# EAGLE board A13-OLinuXino_WIFI_Rev_G2 (EAGLE 9.6.2), part 1 of 3
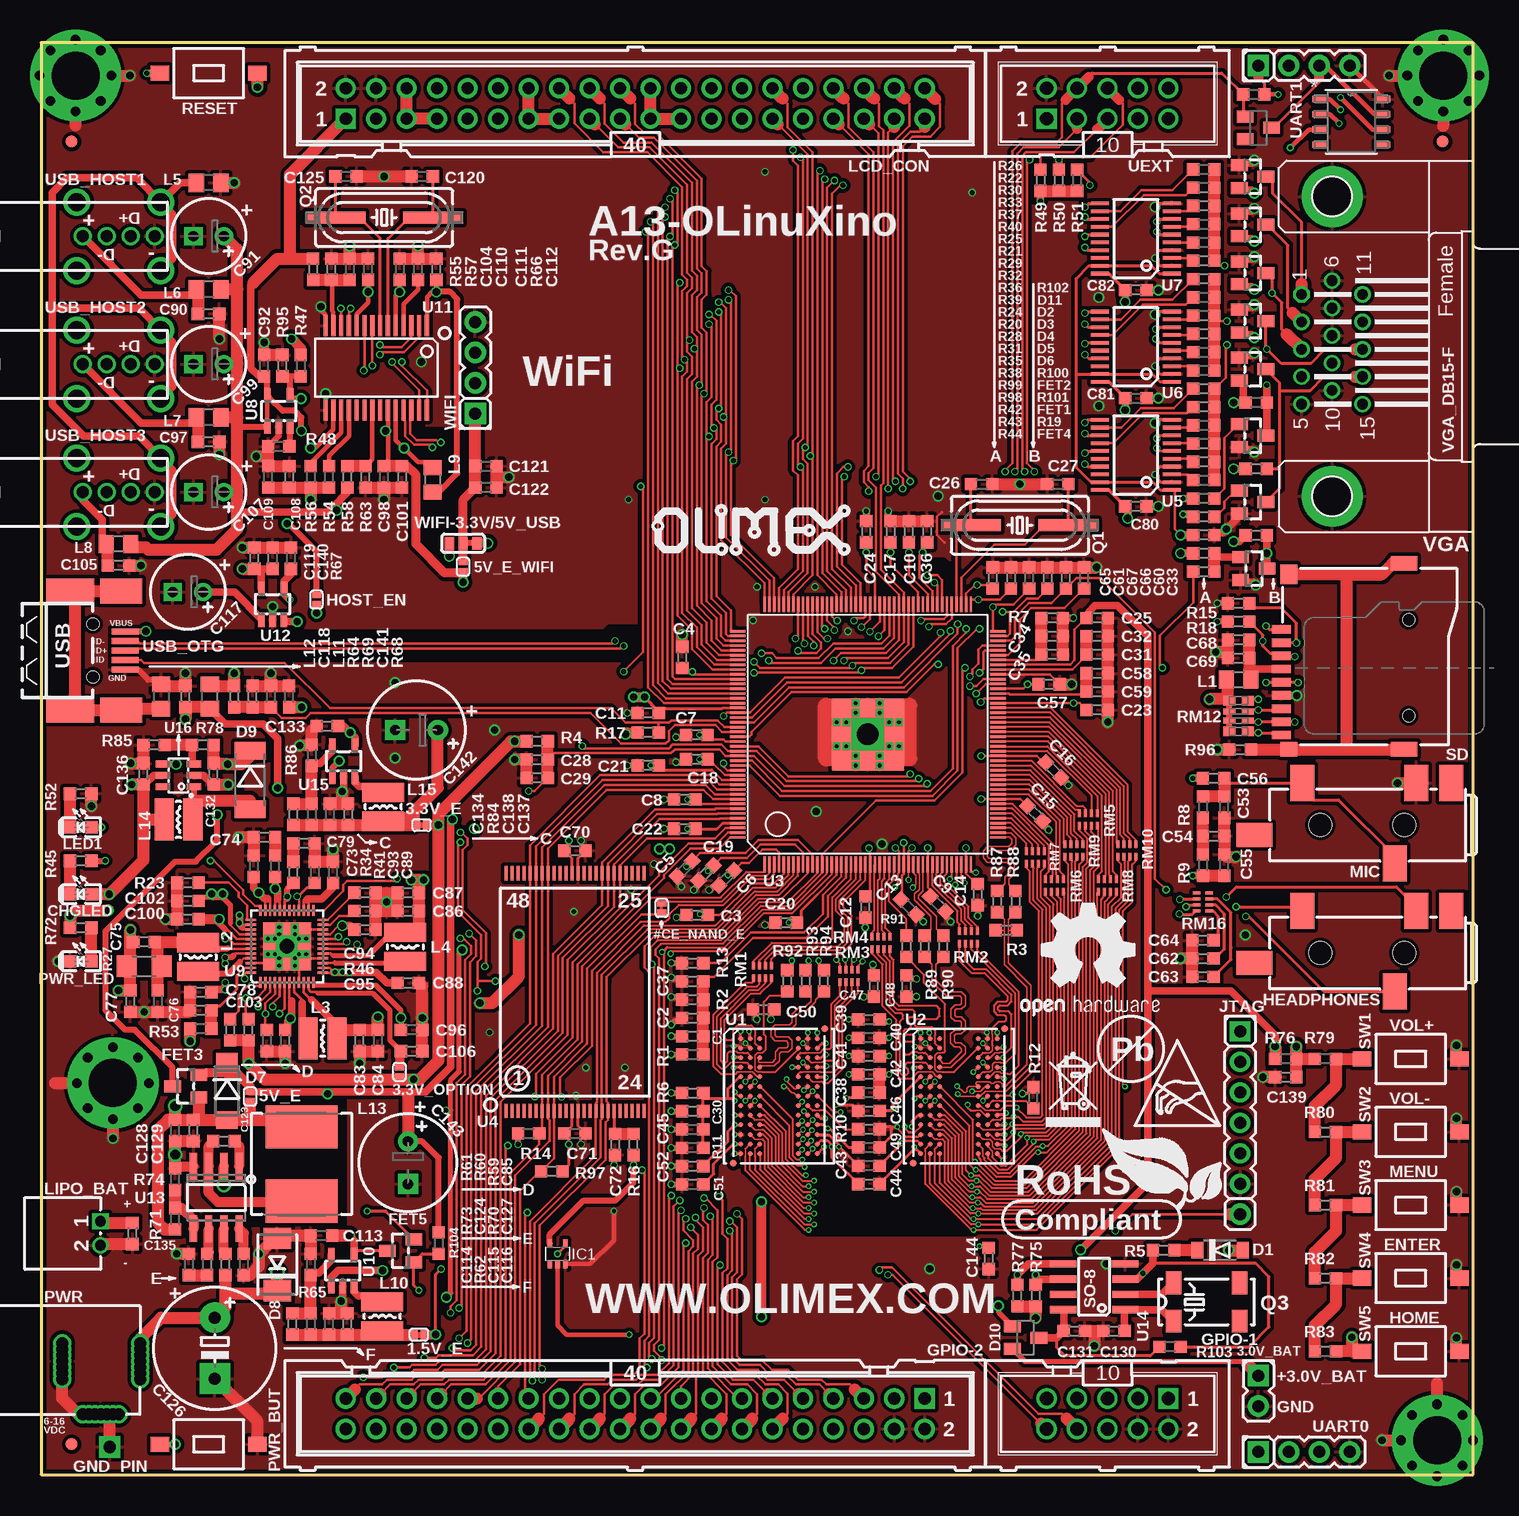
[diagram p2: board, top side]
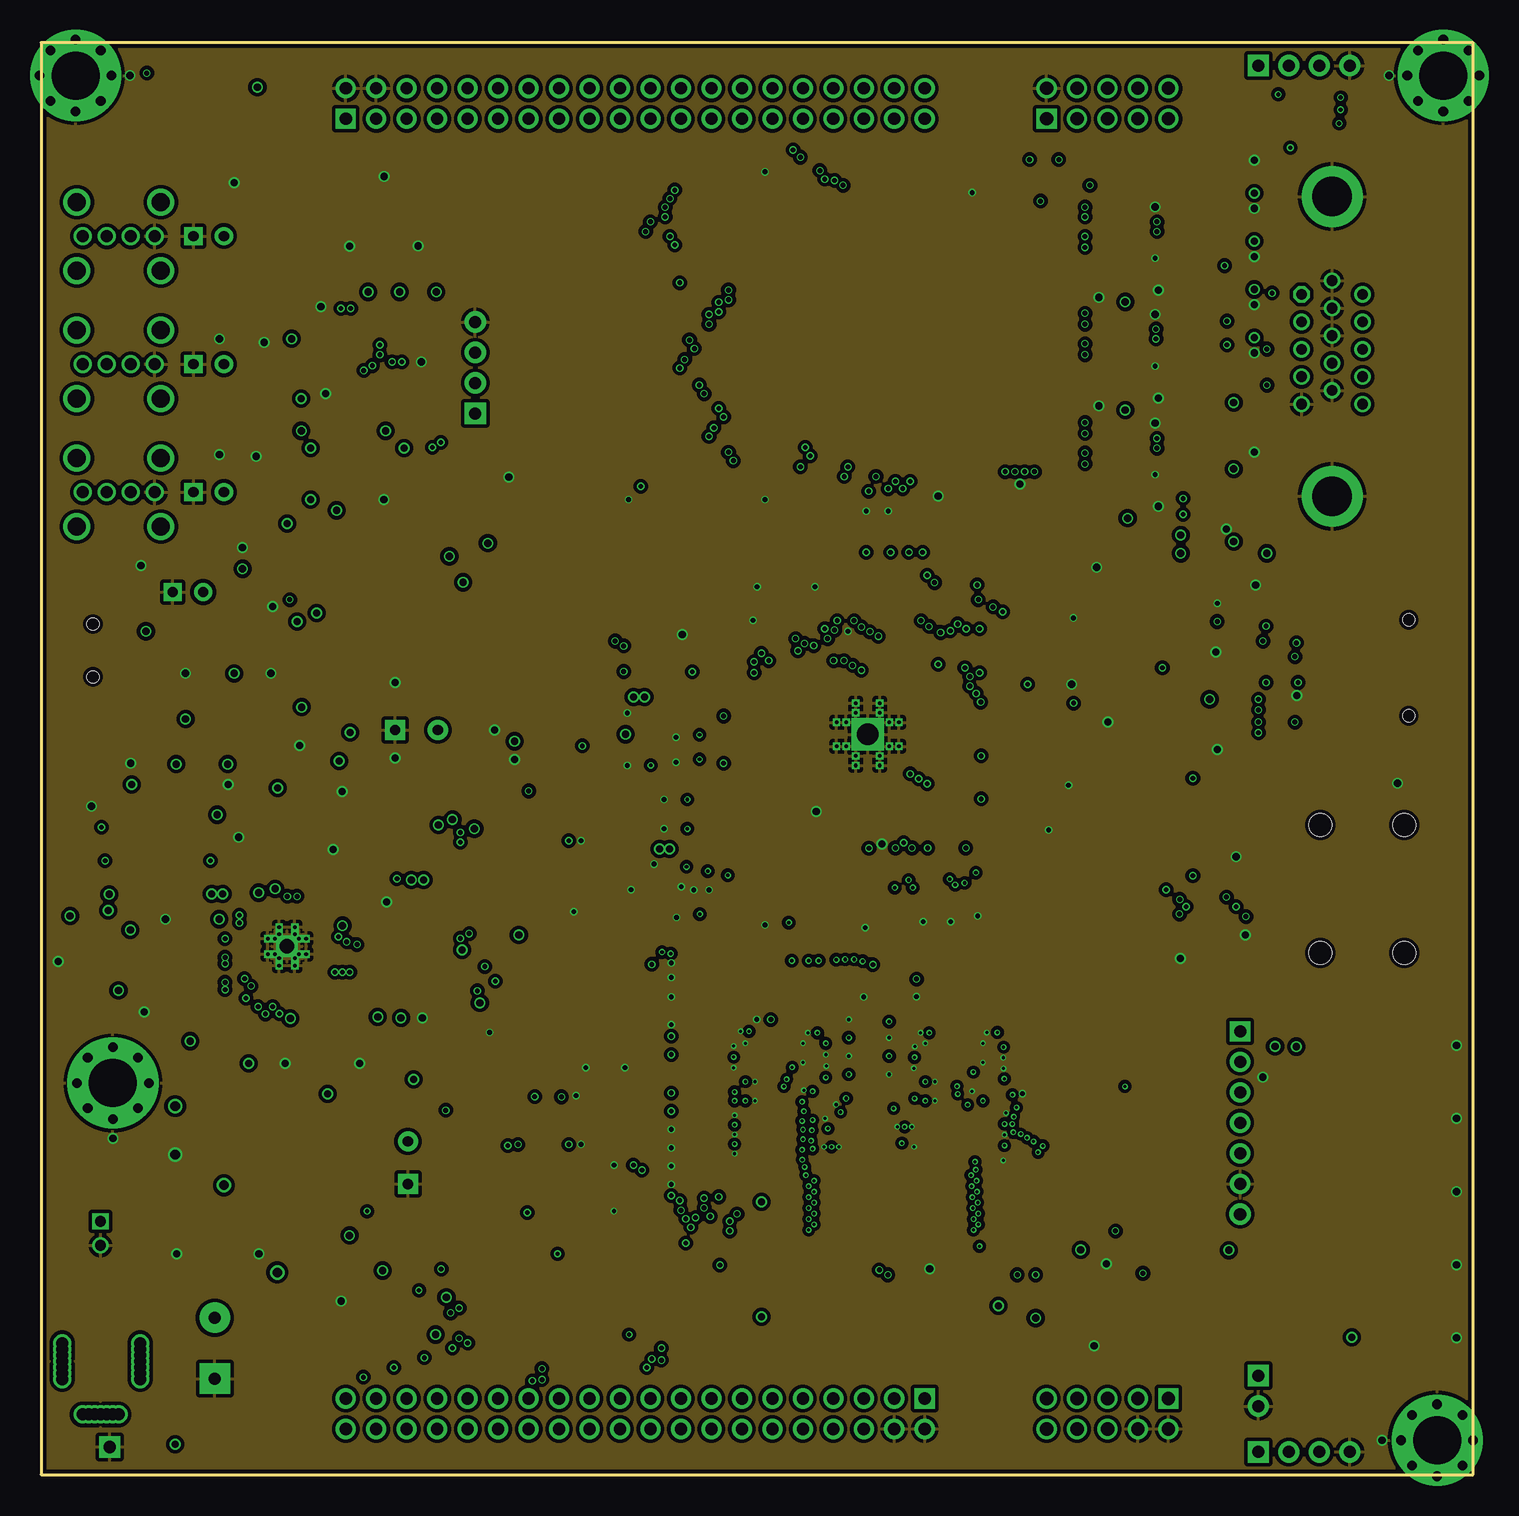
[diagram p3: board, inner layer Route2]
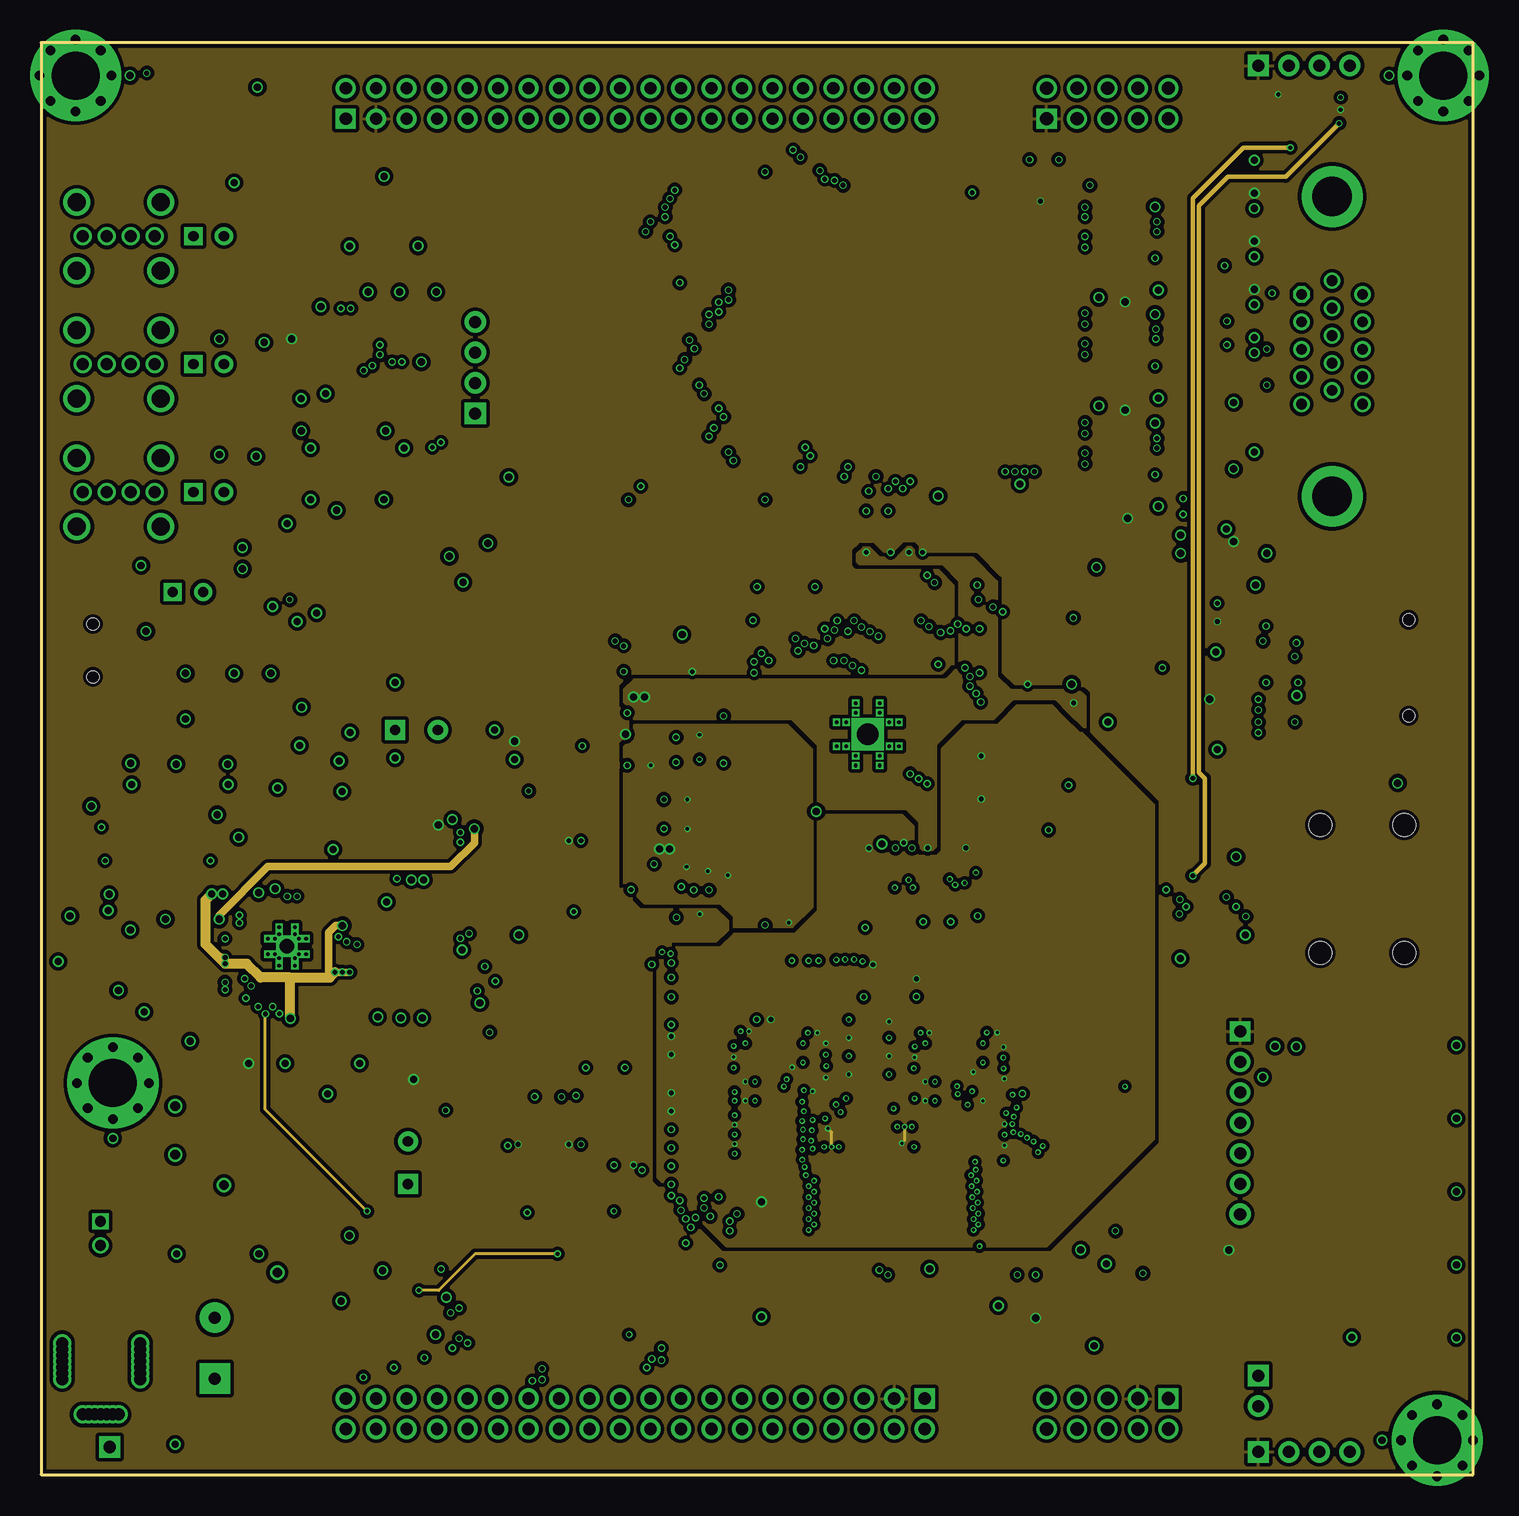
[diagram p4: board, inner layer Route15]
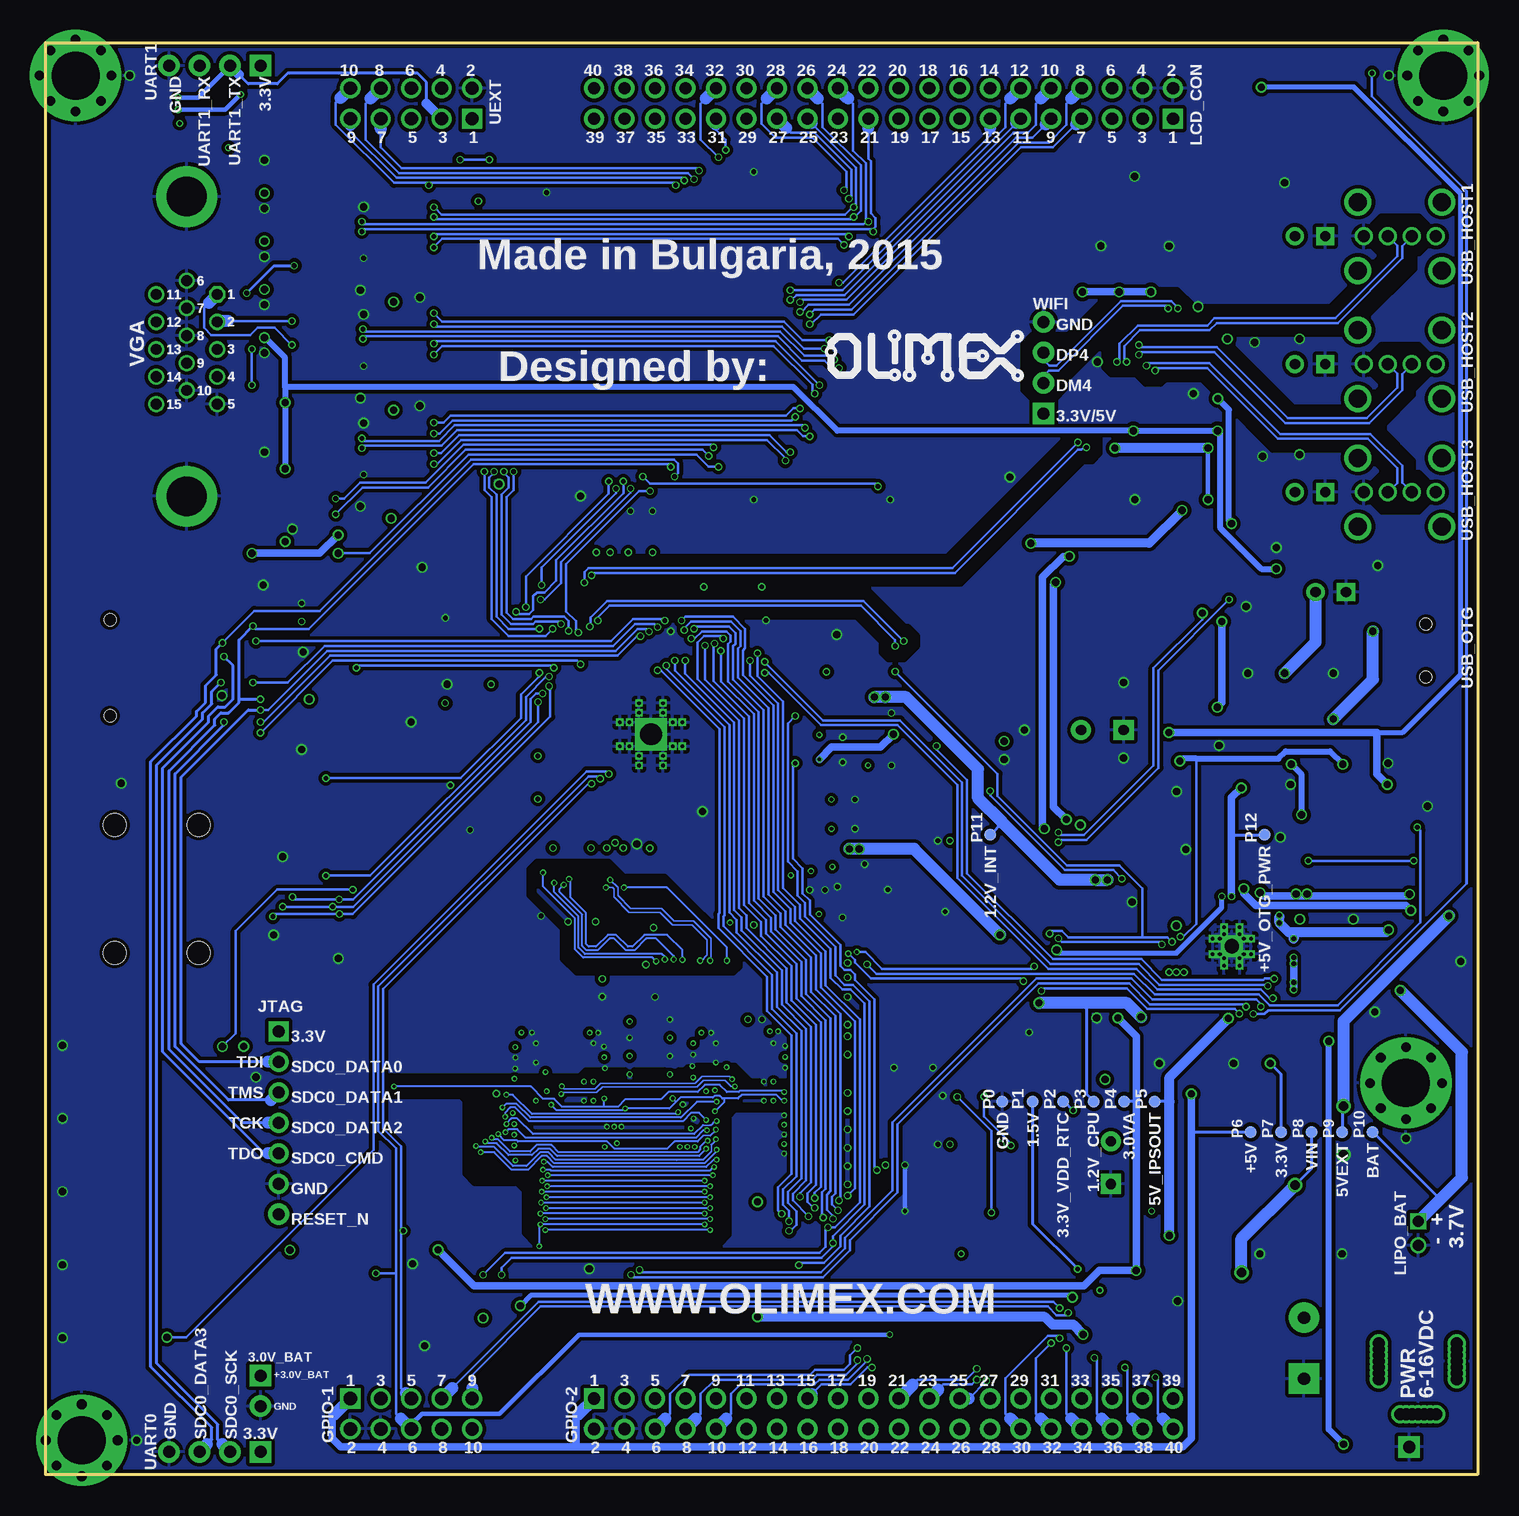
[diagram p5: board, bottom side, seen from below]

Size 119.38 x 119.38 mm. Coordinates in mm from the lower left corner, seen from the top.
Copper layers (1*2*15*16): Top 0.018mm / dielectric 0.12mm / Route2 0.035mm / dielectric 1.2mm / Route15 0.035mm / dielectric 0.12mm / Bottom 0.018mm
Design rules "default": minimum track width 4.5mil, minimum drill 10mil, track to track 0.1321mm, track to pad 0.1321mm, pad to pad 0.1321mm, via to via 0.1321mm, smd to smd 1mil, copper to edge 10mil, drill to drill 8mil, minimum pad ring 6mil, minimum via ring 4mil, stop-mask expansion 4mil, vias tented up to drill 25mil, thermal gap 12mil
tRestrict: 58 lines
bRestrict: 173 lines

## Footprints (pad centres in the part's own frame; a part is rotated, then mirrored left to right if it is on the bottom)
SJ_1_SMALLER_CLOSE = smd 0.508 x 0.762: 1 -0.381,0; 2 0.381,0
HN1X2 = drill 1 pad 1.778 square: 1 -1.27,0 | drill 1 pad 1.778: 2 1.27,0
SJ_1_SMALLER = smd 0.508 x 0.762: 1 -0.381,0; 2 0.381,0
SJ_1_SMALLER_CLOSE_10MILS = smd 0.508 x 0.762: 1 -0.381,0; 2 0.381,0
C0603_DWS = smd 1.016 x 1.016: 1 -0.889,0; 2 0.889,0
E2,5-6,3 = drill 0.864 pad 1.524: + -1.27,0 | drill 0.864 pad 1.524 square: - 1.27,0
E5-10,5 = drill 1.016 pad 2.54: + -2.54,0 | drill 1.016 pad 2.54 square: - 2.54,0
E3,5-8 = drill 0.864 pad 1.676: + -1.778,0 | drill 0.864 pad 1.676 square: - 1.778,0
LED-0603 = smd 1.016 x 1.016: A 0.889,0; C -0.889,0
SOD-123 = smd 1 x 1.4: A 1.9,0; C -1.9,0
SOT23C(BAT54S) = smd 1.4 x 1: 1 1.1,-0.95; 2 1.1,0.95; 3 -1.1,0
MLL-41 = smd 1.45 x 1.8: A 2.445,0; K -2.445,0
DO214AA = smd 1.778 x 2.286: A 2.177,0; C -2.177,0
MELF-MLL41 = smd 1.45 x 2.6: 1 -2.445,0; 2 2.445,0
SOT23C = smd 1.4 x 1: 1 1.1,-0.95; 2 1.1,0.95; 3 -1.1,0
SOT23 = smd 1.4 x 1: 1 1.1,-0.95; 2 1.1,0.95; 3 -1.1,0
TEST_PAD40/70/SQUARE = drill 1.016 pad 1.778 square: P$1 0,0
ML10-MALE = drill 1.1 pad 1.676 square: 1 -5.08,-1.27 | drill 1.1 pad 1.676: 2 -5.08,1.27; 3 -2.54,-1.27; 4 -2.54,1.27; 5 0,-1.27; 6 0,1.27; 7 2.54,-1.27; 8 2.54,1.27; 9 5.08,-1.27; 10 5.08,1.27
ML40 = drill 1.016 pad 1.676 square: 1 -24.13,-1.27 | drill 1.016 pad 1.676: 2 -24.13,1.27; 3 -21.59,-1.27; 4 -21.59,1.27; 5 -19.05,-1.27; 6 -19.05,1.27; 7 -16.51,-1.27; 8 -16.51,1.27; 9 -13.97,-1.27; 10 -13.97,1.27; 11 -11.43,-1.27; 12 -11.43,1.27; 13 -8.89,-1.27; 14 -8.89,1.27; 15 -6.35,-1.27; 16 -6.35,1.27; 17 -3.81,-1.27; 18 -3.81,1.27; 19 -1.27,-1.27; 20 -1.27,1.27; 21 1.27,-1.27; 22 1.27,1.27; 23 3.81,-1.27; 24 3.81,1.27; 25 6.35,-1.27; 26 6.35,1.27; 27 8.89,-1.27; 28 8.89,1.27; 29 11.43,-1.27; 30 11.43,1.27; 31 13.97,-1.27; 32 13.97,1.27; 33 16.51,-1.27; 34 16.51,1.27; 35 19.05,-1.27; 36 19.05,1.27; 37 21.59,-1.27; 38 21.59,1.27; 39 24.13,-1.27; 40 24.13,1.27
PJ-W47S-05D2-LF_5PIN_V2 = smd 2 x 3: 1 2.1,-0.5; 2 14.5,-0.5; 3 6.8,6.2; 5 5,-0.5 | smd 3 x 2: 4 18.5,3.8 | hole 1.9: 6,3; 13,3
SC70-5 = smd 0.4 x 0.7: 1 -0.65,-0.85; 2 0,-0.85; 3 0.65,-0.85; 4 0.65,0.85; 5 -0.65,0.85
HN1X6 = drill 1 pad 1.676 square: 1 -6.35,0 | drill 1 pad 1.676: 2 -3.81,0; 3 -1.27,0; 4 1.27,0; 5 3.81,0; 6 6.35,0
L0805_5MIL_DWS = smd 1.27 x 1.524: 1 -1.016,0; 2 1.016,0
CD32 = smd 1.6 x 3.5: 1 -1.2,0; 2 1.2,0
8X8MM_3131 = smd 3.6 x 6: 1 -3.1,0; 2 3.1,0
DW02R = drill 0.9 square: 1 -1,0 | drill 0.9: 2 1,0
TESTPAD_40-ROUND = smd 1.016 x 1.016: 1 0,0
PWR_JACK_UNI_MILLING = drill 1: + 0,4.75; +1 0,5.25; +2 0,5.75; +3 0,6.25; +4 0,4.25; +5 0,3.75; +6 0,3.25; - -6.5,4.75; -1 -6.5,5.25; -2 -6.5,5.75; -3 -6.5,4.25; -4 -6.5,3.75; -5 -6.5,6.25; -6 -6.5,3.25; -- -3.3,0.3; --1 -3.8,0.3; --2 -4.3,0.3; --3 -4.8,0.3; --4 -2.8,0.3; --5 -2.3,0.3; --6 -1.8,0.3
SW-TAKT_6X3.5_SMD = smd 1.27 x 1.524: P$1 0,4.064; P$2 0,-4.064
HC49/SMD2_THIN = smd 5 x 1: 1 -4.064,0; 2 4.064,0
MC-306 = smd 1.3 x 1.9: 1 -2.75,-1.6; 2 2.75,-1.6; 3 2.75,1.6; 4 -2.75,1.6
R0603_5MIL_DWS = smd 1.016 x 1.016: 1 -0.889,0; 2 0.889,0
R1206_5MIL_WS = smd 1.651 x 1.778: 1 -1.46,0; 2 1.46,0
TESTPAD = drill 1.016 pad 1.778: P$1 0,0
R_MATRIX_4_0402_25X625 = smd 0.25 x 0.625: 1.1 -0.75,-0.512; 1.2 -0.75,0.512; 2.1 -0.25,-0.512; 2.2 -0.25,0.512; 3.1 0.25,-0.512; 3.2 0.25,0.512; 4.1 0.75,-0.512; 4.2 0.75,0.512
R_MATRIX_4 = smd 0.762 x 1.016: 1.1 -1.27,-0.762; 1.2 -1.27,0.762; 4.1 1.27,-0.762; 4.2 1.27,0.762 | smd 0.508 x 1.016: 2.1 -0.381,-0.762; 2.2 -0.381,0.762; 3.1 0.381,-0.762; 3.2 0.381,0.762
TFC-WPAPR-08 = smd 1.6 x 0.7: 1 -7.375,2.25; 2 -7.375,1.15; 3 -7.375,0.05; 4 -7.375,-1.05; 5 -7.375,-2.15; 6 -7.375,-3.25; 7 -7.375,-4.35; 8 -7.375,-5.45; 9 -7.375,-6.55 | smd 1.4 x 1.2: 10 -6.75,-7.75 | smd 1.4 x 1.6: 11 -6.75,6.85 | smd 2.2 x 1.2: 12 2.85,-7.75; 13 2.85,7.75 | hole 1: 3.25,-4.95; 3.25,3.05
FBGA78 = smd 0.4 x 0.4: A1 -4.8,-3.2; A2 -4.8,-2.4; A3 -4.8,-1.6; A7 -4.8,1.6; A8 -4.8,2.4; A9 -4.8,3.2; B1 -4,-3.2; B2 -4,-2.4; B3 -4,-1.6; B7 -4,1.6; B8 -4,2.4; B9 -4,3.2; C1 -3.2,-3.2; C2 -3.2,-2.4; C3 -3.2,-1.6; C7 -3.2,1.6; C8 -3.2,2.4; C9 -3.2,3.2; D1 -2.4,-3.2; D2 -2.4,-2.4; D3 -2.4,-1.6; D7 -2.4,1.6; D8 -2.4,2.4; D9 -2.4,3.2; E1 -1.6,-3.2; E2 -1.6,-2.4; E3 -1.6,-1.6; E7 -1.6,1.6; E8 -1.6,2.4; E9 -1.6,3.2; F1 -0.8,-3.2; F2 -0.8,-2.4; F3 -0.8,-1.6; F7 -0.8,1.6; F8 -0.8,2.4; F9 -0.8,3.2; G1 0,-3.2; G2 0,-2.4; G3 0,-1.6; G7 0,1.6; G8 0,2.4; G9 0,3.2; H1 0.8,-3.2; H2 0.8,-2.4; H3 0.8,-1.6; H7 0.8,1.6; H8 0.8,2.4; H9 0.8,3.2; J1 1.6,-3.2; J2 1.6,-2.4; J3 1.6,-1.6; J7 1.6,1.6; J8 1.6,2.4; J9 1.6,3.2; K1 2.4,-3.2; K2 2.4,-2.4; K3 2.4,-1.6; K7 2.4,1.6; K8 2.4,2.4; K9 2.4,3.2; L1 3.2,-3.2; L2 3.2,-2.4; L3 3.2,-1.6; L7 3.2,1.6; L8 3.2,2.4; L9 3.2,3.2; M1 4,-3.2; M2 4,-2.4; M3 4,-1.6; M7 4,1.6; M8 4,2.4; M9 4,3.2; N1 4.8,-3.2; N2 4.8,-2.4; N3 4.8,-1.6; N7 4.8,1.6; N8 4.8,2.4; N9 4.8,3.2 | smd 0.6 x 0.6: FID1 5.6,-3.8; FID2 -5.6,3.8
TQFP176 = smd 0.2 x 1.3: 1 -8.6,-10.85; 2 -8.2,-10.85; 3 -7.8,-10.85; 4 -7.4,-10.85; 5 -7,-10.85; 6 -6.6,-10.85; 7 -6.2,-10.85; 8 -5.8,-10.85; 9 -5.4,-10.85; 10 -5,-10.85; 11 -4.6,-10.85; 12 -4.2,-10.85; 13 -3.8,-10.85; 14 -3.4,-10.85; 15 -3,-10.85; 16 -2.6,-10.85; 17 -2.2,-10.85; 18 -1.8,-10.85; 19 -1.4,-10.85; 20 -1,-10.85; 21 -0.6,-10.85; 22 -0.2,-10.85; 23 0.2,-10.85; 24 0.6,-10.85; 25 1,-10.85; 26 1.4,-10.85; 27 1.8,-10.85; 28 2.2,-10.85; 29 2.6,-10.85; 30 3,-10.85; 31 3.4,-10.85; 32 3.8,-10.85; 33 4.2,-10.85; 34 4.6,-10.85; 35 5,-10.85; 36 5.4,-10.85; 37 5.8,-10.85; 38 6.2,-10.85; 39 6.6,-10.85; 40 7,-10.85; 41 7.4,-10.85; 42 7.8,-10.85; 43 8.2,-10.85; 44 8.6,-10.85; 89 8.6,10.85; 90 8.2,10.85; 91 7.8,10.85; 92 7.4,10.85; 93 7,10.85; 94 6.6,10.85; 95 6.2,10.85; 96 5.8,10.85; 97 5.4,10.85; 98 5,10.85; 99 4.6,10.85; 100 4.2,10.85; 101 3.8,10.85; 102 3.4,10.85; 103 3,10.85; 104 2.6,10.85; 105 2.2,10.85; 106 1.8,10.85; 107 1.4,10.85; 108 1,10.85; 109 0.6,10.85; 110 0.2,10.85; 111 -0.2,10.85; 112 -0.6,10.85; 113 -1,10.85; 114 -1.4,10.85; 115 -1.8,10.85; 116 -2.2,10.85; 117 -2.6,10.85; 118 -3,10.85; 119 -3.4,10.85; 120 -3.8,10.85; 121 -4.2,10.85; 122 -4.6,10.85; 123 -5,10.85; 124 -5.4,10.85; 125 -5.8,10.85; 126 -6.2,10.85; 127 -6.6,10.85; 128 -7,10.85; 129 -7.4,10.85; 130 -7.8,10.85; 131 -8.2,10.85; 132 -8.6,10.85 | smd 1.3 x 0.2: 45 10.85,-8.6; 46 10.85,-8.2; 47 10.85,-7.8; 48 10.85,-7.4; 49 10.85,-7; 50 10.85,-6.6; 51 10.85,-6.2; 52 10.85,-5.8; 53 10.85,-5.4; 54 10.85,-5; 55 10.85,-4.6; 56 10.85,-4.2; 57 10.85,-3.8; 58 10.85,-3.4; 59 10.85,-3; 60 10.85,-2.6; 61 10.85,-2.2; 62 10.85,-1.8; 63 10.85,-1.4; 64 10.85,-1; 65 10.85,-0.6; 66 10.85,-0.2; 67 10.85,0.2; 68 10.85,0.6; 69 10.85,1; 70 10.85,1.4; 71 10.85,1.8; 72 10.85,2.2; 73 10.85,2.6; 74 10.85,3; 75 10.85,3.4; 76 10.85,3.8; 77 10.85,4.2; 78 10.85,4.6; 79 10.85,5; 80 10.85,5.4; 81 10.85,5.8; 82 10.85,6.2; 83 10.85,6.6; 84 10.85,7; 85 10.85,7.4; 86 10.85,7.8; 87 10.85,8.2; 88 10.85,8.6; 133 -10.85,8.6; 134 -10.85,8.2; 135 -10.85,7.8; 136 -10.85,7.4; 137 -10.85,7; 138 -10.85,6.6; 139 -10.85,6.2; 140 -10.85,5.8; 141 -10.85,5.4; 142 -10.85,5; 143 -10.85,4.6; 144 -10.85,4.2; 145 -10.85,3.8; 146 -10.85,3.4; 147 -10.85,3; 148 -10.85,2.6; 149 -10.85,2.2; 150 -10.85,1.8; 151 -10.85,1.4; 152 -10.85,1; 153 -10.85,0.6; 154 -10.85,0.2; 155 -10.85,-0.2; 156 -10.85,-0.6; 157 -10.85,-1; 158 -10.85,-1.4; 159 -10.85,-1.8; 160 -10.85,-2.2; 161 -10.85,-2.6; 162 -10.85,-3; 163 -10.85,-3.4; 164 -10.85,-3.8; 165 -10.85,-4.2; 166 -10.85,-4.6; 167 -10.85,-5; 168 -10.85,-5.4; 169 -10.85,-5.8; 170 -10.85,-6.2; 171 -10.85,-6.6; 172 -10.85,-7; 173 -10.85,-7.4; 174 -10.85,-7.8; 175 -10.85,-8.2; 176 -10.85,-8.6 | smd 6 x 6: GND_PAD 0,0 | drill 1.8 pad 2.184 square: P$2 0,0 | drill 0.3 pad 0.406 square: P$3 -2.6,-1; P$4 -1.8,-1; P$5 -1,-2.6; P$6 -1,-1.8; P$7 1,-2.6; P$8 1,-1.8; P$9 2.6,-1; P$10 1.8,-1; P$11 -2.6,1; P$12 -1.8,1; P$13 2.6,1; P$14 1.8,1; P$15 -1,2.6; P$16 -1,1.8; P$17 1,2.6; P$18 1,1.8
TSOP48 = smd 1.2 x 0.25: 1 -9.9,5.75; 2 -9.9,5.25; 3 -9.9,4.75; 4 -9.9,4.25; 5 -9.9,3.75; 6 -9.9,3.25; 7 -9.9,2.75; 8 -9.9,2.25; 9 -9.9,1.75; 10 -9.9,1.25; 11 -9.9,0.75; 12 -9.9,0.25; 13 -9.9,-0.25; 14 -9.9,-0.75; 15 -9.9,-1.25; 16 -9.9,-1.75; 17 -9.9,-2.25; 18 -9.9,-2.75; 19 -9.9,-3.25; 20 -9.9,-3.75; 21 -9.9,-4.25; 22 -9.9,-4.75; 23 -9.9,-5.25; 24 -9.9,-5.75; 25 9.9,-5.75; 26 9.9,-5.25; 27 9.9,-4.75; 28 9.9,-4.25; 29 9.9,-3.75; 30 9.9,-3.25; 31 9.9,-2.75; 32 9.9,-2.25; 33 9.9,-1.75; 34 9.9,-1.25; 35 9.9,-0.75; 36 9.9,-0.25; 37 9.9,0.25; 38 9.9,0.75; 39 9.9,1.25; 40 9.9,1.75; 41 9.9,2.25; 42 9.9,2.75; 43 9.9,3.25; 44 9.9,3.75; 45 9.9,4.25; 46 9.9,4.75; 47 9.9,5.25; 48 9.9,5.75
PW = smd 0.3 x 1.5: 1 -2.925,-3; 2 -2.275,-3; 3 -1.625,-3; 4 -0.975,-3; 5 -0.325,-3; 6 0.325,-3; 7 0.975,-3; 8 1.625,-3; 9 2.275,-3; 10 2.925,-3; 11 2.925,3; 12 2.275,3; 13 1.625,3; 14 0.975,3; 15 0.325,3; 16 -0.325,3; 17 -0.975,3; 18 -1.625,3; 19 -2.275,3; 20 -2.925,3
SOT23-5 = smd 1.2 x 0.55: 1 1.3,-0.95; 2 1.3,0; 3 1.3,0.95; 4 -1.3,0.95; 5 -1.3,-0.95
QFN48 = smd 0.2 x 0.9: 1 -2.2,-3; 2 -1.8,-3; 3 -1.4,-3; 4 -1,-3; 5 -0.6,-3; 6 -0.2,-3; 7 0.2,-3; 8 0.6,-3; 9 1,-3; 10 1.4,-3; 11 1.8,-3; 12 2.2,-3; 25 2.2,3; 26 1.8,3; 27 1.4,3; 28 1,3; 29 0.6,3; 30 0.2,3; 31 -0.2,3; 32 -0.6,3; 33 -1,3; 34 -1.4,3; 35 -1.8,3; 36 -2.2,3 | smd 0.9 x 0.2: 13 3,-2.2; 14 3,-1.8; 15 3,-1.4; 16 3,-1; 17 3,-0.6; 18 3,-0.2; 19 3,0.2; 20 3,0.6; 21 3,1; 22 3,1.4; 23 3,1.8; 24 3,2.2; 37 -3,2.2; 38 -3,1.8; 39 -3,1.4; 40 -3,1; 41 -3,0.6; 42 -3,0.2; 43 -3,-0.2; 44 -3,-0.6; 45 -3,-1; 46 -3,-1.4; 47 -3,-1.8; 48 -3,-2.2 | drill 1.2 pad 1.422 square: N1 0,0 | drill 0.3 pad 0.4 square: N2 -1.6,0.65; N3 -1,0.65; N4 -1.6,-0.65; N5 -1,-0.65; N6 -0.65,-1.6; N7 -0.65,-1; N8 0.65,-1.6; N9 0.65,-1; N10 1.6,-0.65; N11 1,-0.65; N12 1.6,0.65; N13 1,0.65; N14 0.65,1.6; N15 0.65,1; N16 -0.65,1.6; N17 -0.65,1 | smd 4 x 4: VSS 0,0
SSOP28 = smd 0.35 x 1.75: 1 -4.225,-3.525; 2 -3.575,-3.525; 3 -2.925,-3.525; 4 -2.275,-3.525; 5 -1.625,-3.525; 6 -0.975,-3.525; 7 -0.325,-3.525; 8 0.325,-3.525; 9 0.975,-3.525; 10 1.625,-3.525; 11 2.275,-3.525; 12 2.925,-3.525; 13 3.575,-3.525; 14 4.225,-3.525; 15 4.225,3.525; 16 3.575,3.525; 17 2.925,3.525; 18 2.275,3.525; 19 1.625,3.525; 20 0.975,3.525; 21 0.325,3.525; 22 -0.325,3.525; 23 -0.975,3.525; 24 -1.625,3.525; 25 -2.275,3.525; 26 -2.925,3.525; 27 -3.575,3.525; 28 -4.225,3.525
SOIC8 = smd 0.6 x 2.2: 1 -1.905,-2.6; 2 -0.635,-2.6; 3 0.635,-2.6; 4 1.905,-2.6; 5 1.905,2.6; 6 0.635,2.6; 7 -0.635,2.6; 8 -1.905,2.6
SO-8 = smd 0.6 x 2.2: 1 -1.905,-2.6; 2 -0.635,-2.6; 3 0.635,-2.6; 4 1.905,-2.6; 5 1.905,2.6; 6 0.635,2.6; 7 -0.635,2.6; 8 -1.905,2.6
SOT23-6 = smd 1.2 x 0.55: 1 1.3,-0.95; 2 1.3,0; 3 1.3,0.95; 4 -1.3,0.95; 5 -1.3,0; 6 -1.3,-0.95
SOIC8_SA_SST_MCH-L = smd 1.255 x 0.508: 1 -2.621,1.905; 2 -2.621,0.635; 3 -2.621,-0.635; 4 -2.621,-1.905; 5 2.621,-1.905; 6 2.621,-0.635; 7 2.621,0.635; 8 2.621,1.905
FIDUCIAL-1X2 = smd 1 x 1: 1 0,0
NANO-ITX_120X120 = drill 4 pad 7.6: GND 2.496,2.746; P$2 3.006,116.506; P$3 116.506,2.746; P$4 113.396,86.726 | drill 0.8: P$11 -0.504,2.746; P$12 5.496,2.746; P$13 2.496,5.746; P$14 2.496,-0.254; P$15 0.396,0.646; P$16 4.596,0.646; P$17 4.596,4.846; P$18 0.396,4.846; P$20 0.006,116.506; P$21 6.006,116.506; P$22 3.006,119.506; P$23 3.006,113.506; P$24 0.906,114.406; P$25 5.106,114.406; P$26 5.106,118.606; P$27 0.906,118.606; P$29 113.506,2.746; P$30 119.506,2.746; P$31 116.506,5.746; P$32 116.506,-0.254; P$33 114.406,0.646; P$34 118.606,0.646; P$35 118.606,4.846; P$36 114.406,4.846; P$38 110.396,86.726; P$39 116.396,86.726; P$40 113.396,89.726; P$41 113.396,83.726; P$42 111.296,84.626; P$43 115.496,84.626; P$44 115.496,88.826; P$45 111.296,88.826
HN1X4 = drill 1 pad 1.778 square: 1 -3.81,0 | drill 1 pad 1.778: 2 -1.27,0; 3 1.27,0; 4 3.81,0
USB_A_VERTICAL_PTH = drill 1: 1 3.45,12.75; 2 3.45,14.75; 3 3.45,16.75; 4 3.45,18.75 | drill 1.5: P$1 0.6,12.25; P$2 6.3,12.25; P$3 6.3,19.25; P$4 0.6,19.25
USB_MINI_9PIN = smd 2.25 x 0.5: D+ 2.706,0; D- 2.706,0.8; GND 2.706,-1.6; ID 2.706,-0.8; VBUS 2.706,1.6 | smd 4 x 2.1: GND1 -1.9,4.95; GND3 -1.9,-4.95 | smd 3.5 x 2.1: GND2 2.35,4.95; GND4 2.35,-4.95 | hole 1: 0,2.2; 0,-2.2
DB15-F_22MM = drill 0.9 octagon: 1 4.329,6.35 | drill 0.9: 2 2.043,6.35; 3 -0.243,6.35; 4 -2.529,6.35; 5 -4.815,6.35; 6 5.472,3.81; 7 3.186,3.81; 8 0.9,3.81; 9 -1.386,3.81; 10 -3.672,3.81; 11 4.329,1.27; 12 2.043,1.27; 13 -0.243,1.27; 14 -2.529,1.27; 15 -4.815,1.27 | drill 3.302 pad 5.08: GND1 -12.497,3.81; GND2 12.497,3.81
SJ_2_SMALL_12_TIED = smd 0.762 x 1.016: 1 -1.143,0; 2 0,0; 3 1.143,0

## Placement (x,y rotation side)
1.5V_E  Close  [SJ_1_SMALLER_CLOSE]  31.5,11.68 0 top
3.0V_BAT  NA(HN1X2)  [HN1X2]  101.47,6.99 270 top
3.3V_E  Close  [SJ_1_SMALLER_CLOSE]  31.72,54.15 0 top
3.3V_OPTION  Open  [SJ_1_SMALLER]  29.87,33.58 270 top
5V_E  Open  [SJ_1_SMALLER]  17.42,31.52 90 top
5V_E_WIFI  Open  [SJ_1_SMALLER]  35.18,75.69 90 top
#CE_NAND_E  Close  [SJ_1_SMALLER_CLOSE_10MILS]  51.74,47.24 90 top
C1  100nF  [C0603_DWS]  54.31,36.55 0 top
C2  100nF  [C0603_DWS]  54.31,38.07 0 top
C3  100nF  [C0603_DWS]  54.69,46.66 0 top
C4  100nF  [C0603_DWS]  53.44,68.12 270 top
C5  22uF/6.3V  [C0603_DWS]  53.65,50.52 45 top
C6  10uF/6.3V  [C0603_DWS]  57.14,49.74 45 top
C7  10uF/6.3V  [C0603_DWS]  54.66,61.67 0 top
C8  10uF/6.3V  [C0603_DWS]  53.64,56.29 0 top
C9  22uF/6.3V  [C0603_DWS]  74.75,47.57 135 top
C10  10uF/6.3V  [C0603_DWS]  72.34,78.61 270 top
C11  10uF/6.3V  [C0603_DWS]  50.6,63.5 0 top
C12  22uF/6.3V  [C0603_DWS]  68.71,47.32 90 top
C13  100nF  [C0603_DWS]  72.31,47.32 135 top
C14  10uF/6.3V  [C0603_DWS]  78.08,48.36 90 top
C15  100nF  [C0603_DWS]  82.85,55.12 135 top
C16  10uF/6.3V  [C0603_DWS]  84.38,58.75 135 top
C17  100nF  [C0603_DWS]  70.82,78.61 270 top
C18  22uF/6.3V  [C0603_DWS]  54.66,59.64 0 top
C19  100nF  [C0603_DWS]  55.43,50.16 45 top
C20  100nF  [C0603_DWS]  62.1,46.02 0 top
C21  100nF  [C0603_DWS]  50.6,59.13 0 top
C22  100nF  [C0603_DWS]  53.64,53.85 0 top
C23  100nF  [C0603_DWS]  88.04,63.75 180 top
C24  100nF  [C0603_DWS]  68.78,78.61 270 top
C25  22uF/6.3V  [C0603_DWS]  88.04,71.42 180 top
C26  33pF  [C0603_DWS]  78.41,82.58 180 top
C27  33pF  [C0603_DWS]  84.76,82.58 0 top
C28  1uF  [C0603_DWS]  41.35,59.61 0 top
C29  100nF  [C0603_DWS]  41.35,58.09 0 top
C30  100nF  [C0603_DWS]  54.31,30.3 0 top
C31  10uF/6.3V  [C0603_DWS]  88.04,68.38 180 top
C32  100nF  [C0603_DWS]  88.04,69.9 180 top
C33  1uF  [C0603_DWS]  86.94,74.75 270 top
C34  100nF  [C0603_DWS]  84.28,69.9 180 top
C35  10uF/6.3V  [C0603_DWS]  84.28,68.38 180 top
C36  100nF  [C0603_DWS]  73.86,78.61 270 top
C37  100nF  [C0603_DWS]  54.31,41.12 0 top
C38  100nF  [C0603_DWS]  69.01,31.85 180 top
C39  100nF  [C0603_DWS]  69.01,37.95 0 top
C40  100nF  [C0603_DWS]  69.01,36.42 180 top
C41  100nF  [C0603_DWS]  69.01,34.9 0 top
C42  22uF/6.3V  [C0603_DWS]  69.01,33.38 180 top
C43  100nF  [C0603_DWS]  69.01,25.76 0 top
C44  100nF  [C0603_DWS]  69.01,24.23 180 top
C45  100nF  [C0603_DWS]  54.31,28.78 0 top
C46  100nF  [C0603_DWS]  69.01,30.33 0 top
C47  100nF  [C0603_DWS]  69.42,40.74 90 top
C48  100nF  [C0603_DWS]  72.14,40.74 90 top
C49  100nF  [C0603_DWS]  69.01,27.28 180 top
C50  100nF  [C0603_DWS]  60.22,38.79 0 top
C51  100nF  [C0603_DWS]  54.31,24.21 0 top
C52  22uF/6.3V  [C0603_DWS]  54.31,25.73 0 top
C53  3.3nF  [C0603_DWS]  98.63,55.65 90 top
C54  10uF/6.3V  [C0603_DWS]  97.74,53.24 180 top
C55  10uF/6.3V  [C0603_DWS]  98.63,50.83 270 top
C56  100nF  [C0603_DWS]  97.74,58.06 180 top
C57  100nF  [C0603_DWS]  84.02,65.89 180 top
C58  10uF/6.3V  [C0603_DWS]  88.04,66.8 180 top
C59  100nF  [C0603_DWS]  88.04,65.28 180 top
C60  1nF  [C0603_DWS]  85.42,74.75 270 top
C61  1nF  [C0603_DWS]  80.85,74.75 270 top
C62  100nF  [C0603_DWS]  96.85,43.03 0 top
C63  100nF  [C0603_DWS]  96.85,41.5 0 top
C64  100nF  [C0603_DWS]  96.85,44.55 0 top
C65  1nF  [C0603_DWS]  79.32,74.75 270 top
C66  1nF  [C0603_DWS]  83.9,74.75 270 top
C67  1nF  [C0603_DWS]  82.37,74.75 270 top
C68  22uF/6.3V  [C0603_DWS]  99.82,69.6 0 top
C69  22uF/6.3V  [C0603_DWS]  99.82,68.07 0 top
C70  100nF  [C0603_DWS]  44.5,52.02 180 top
C71  22uF/6.3V  [C0603_DWS]  44.5,28.45 180 top
C72  100nF  [C0603_DWS]  47.85,27.53 90 top
C73  10uF/6.3V  [C0603_DWS]  17.73,50.72 270 top
C74  10uF/6.3V  [C0603_DWS]  18.62,53.14 0 top
C75  1uF  [C0603_DWS]  8.59,44.42 180 top
C76  10uF/6.3V  [C0603_DWS]  9.73,39.47 270 top
C77  10uF/6.3V  [C0603_DWS]  7.44,39.47 270 top
C78  10uF/6.3V  [C0603_DWS]  13.31,40.23 180 top
C79  10uF/6.3V  [C0603_DWS]  21.92,52.63 180 top
C80  100nF  [C0603_DWS]  91.26,80.72 0 top
C81  100nF  [C0603_DWS]  91.26,89.74 0 top
C82  100nF  [C0603_DWS]  91.26,98.76 0 top
C83  10uF/6.3V  [C0603_DWS]  26.54,36.2 270 top
C84  1nF  [C0603_DWS]  28.07,36.2 270 top
C85  10uF/6.3V  [C0603_DWS]  20.35,36.2 270 top
C86  10uF/6.3V  [C0603_DWS]  30.61,46.99 180 top
C87  1nF  [C0603_DWS]  30.61,48.51 180 top
C88  10uF/6.3V  [C0603_DWS]  30.61,41 0 top
C89  1uF  [C0603_DWS]  24.33,50.22 270 top
C90  100nF  [C0603_DWS]  13.97,96.77 0 top
C91  100uF/16V/LOWESR/105C/6.3x11mm_RM2.5  [E2,5-6,3]  13.97,103.25 180 top
C92  10uF/6.3V  [C0603_DWS]  18.59,92.46 90 top
C93  10uF/6.3V  [C0603_DWS]  22.81,50.22 90 top
C94  1uF  [C0603_DWS]  27,48.51 180 top
C95  10uF/6.3V  [C0603_DWS]  27,45.44 180 top
C96  10uF/6.3V  [C0603_DWS]  30.89,37.08 0 top
C97  100nF  [C0603_DWS]  13.97,86.11 0 top
C98  10uF/6.3V  [C0603_DWS]  28.57,83.19 270 top
C99  100uF/16V/LOWESR/105C/6.3x11mm_RM2.5  [E2,5-6,3]  13.97,92.58 180 top
C100  10uF/6.3V  [C0603_DWS]  12.24,46.3 180 top
C101  100nF  [C0603_DWS]  30.1,83.19 270 top
C102  10uF/6.3V  [C0603_DWS]  12.24,47.83 180 top
C103  1nF  [C0603_DWS]  13.31,38.71 0 top
C104  1uF  [C0603_DWS]  25.73,100.48 270 top
C105  100nF  [C0603_DWS]  6.45,75.79 0 top
C106  NA(10uF/6.3V)  [C0603_DWS]  30.89,35.31 0 top
C107  100uF/16V/LOWESR/105C/6.3x11mm_RM2.5  [E2,5-6,3]  13.97,81.92 180 top
C108  100nF  [C0603_DWS]  20.7,83.19 90 top
C109  10uF/6.3V  [C0603_DWS]  18.92,83.19 90 top
C110  100nF  [C0603_DWS]  27.25,100.48 90 top
C111  100nF  [C0603_DWS]  29.9,100.48 90 top
C112  100nF  [C0603_DWS]  32.94,100.48 90 top
C113  22uF/6.3V  [C0603_DWS]  23.37,19.94 180 top
C114  22pF  [C0603_DWS]  20.95,12.57 90 top
C115  22uF/6.3V  [C0603_DWS]  24,12.57 90 top
C116  22uF/6.3V  [C0603_DWS]  25.53,12.57 90 top
C117  100uF/16V/LOWESR/105C/6.3x11mm_RM2.5  [E2,5-6,3]  12.24,73.58 180 top
C118  100nF  [C0603_DWS]  12.04,64.87 90 top
C119  100nF  [C0603_DWS]  17.78,76.4 90 top
C120  33pF  [C0603_DWS]  31.78,108.23 0 top
C121  10uF/6.3V  [C0603_DWS]  37.08,84.07 0 top
C122  100nF  [C0603_DWS]  37.08,82.3 0 top
C123  10nF  [C0603_DWS]  15.24,27.81 180 top
C124  3.3nF  [C0603_DWS]  13.84,17.53 270 top
C125  33pF  [C0603_DWS]  25.43,108.23 180 top
C126  470uF/25V/LOWESR/105C  [E5-10,5]  14.48,10.54 270 top
C127  100nF  [C0603_DWS]  16.89,17.53 270 top
C128  22uF/6.3V  [C0603_DWS]  11.18,28.7 270 top
C129  22uF/6.3V  [C0603_DWS]  12.7,28.7 270 top
C130  10pF  [C0603_DWS]  89.43,11.99 180 top
C131  100nF  [C0603_DWS]  86.13,11.99 180 top
C132  22uF/6.3V  [C0603_DWS]  14.38,58.42 270 top
C133  22uF/6.3V  [C0603_DWS]  23.85,62.41 180 top
C134  47pF  [C0603_DWS]  21.03,55.04 90 top
C135  22uF/6.3V  [C0603_DWS]  7.62,20.12 90 top
C136  22uF/6.3V  [C0603_DWS]  8.53,58.42 270 top
C137  22uF/6.3V  [C0603_DWS]  25.6,55.04 90 top
C138  22uF/6.3V  [C0603_DWS]  24.08,55.04 90 top
C139  1nF  [C0603_DWS]  103.76,33.15 180 top
C140  22uF  [C0603_DWS]  19.3,76.4 90 top
C141  100nF  [C0603_DWS]  19.15,64.87 90 top
C142  NA  [E3,5-8]  31.29,62.08 180 top
C143  NA  [E3,5-8]  30.58,26.01 270 top
C144  100pF  [C0603_DWS]  78.99,18.03 270 top
CHGLED  LED/YELLOW/0603  [LED-0603]  3.3,48.39 0 top
D1  1N5819(S4SOD-123)  [SOD-123]  98.27,18.72 0 top
D2  BAT54S  [SOT23C(BAT54S)]  100.99,108.2 180 top
D3  BAT54S  [SOT23C(BAT54S)]  100.99,104.19 180 top
D4  BAT54S  [SOT23C(BAT54S)]  100.99,100.18 180 top
D5  BAT54S  [SOT23C(BAT54S)]  100.99,96.16 180 top
D6  BAT54S  [SOT23C(BAT54S)]  100.99,92.15 180 top
D7  1N5822/SS34/SMA  [MLL-41]  15.49,32 270 top
D8  SMBJ16A  [DO214AA]  19.68,17.53 90 top
D9  1N5822/SS34/SMA  [MELF-MLL41]  17.42,57.91 270 top
D10  BAT54C  [SOT23C]  82.07,11.43 180 top
D11  BAT54C  [SOT23C]  101.47,112.27 180 top
FET1  BSS138  [SOT23]  100.99,81.08 180 top
FET2  BSS138  [SOT23]  100.99,86.61 180 top
FET3  IRLML6402  [SOT23]  12.06,32.38 0 top
FET4  BSS138  [SOT23]  101.09,75.54 180 top
FET5  BSS138  [SOT23]  29.97,18.67 0 top
GND_PIN  TESTPAD3  [TEST_PAD40/70/SQUARE]  5.71,2.31 0 top
GPIO-1  BH10S  [ML10-MALE]  88.9,5.08 180 top
GPIO-2  ML40  [ML40]  49.53,5.08 180 top
HEADPHONES  PJ-W47S-05D2-LF_V2  [PJ-W47S-05D2-LF_5PIN_V2]  119.63,46.48 180 top
HOST_EN  Open  [SJ_1_SMALLER]  22.96,72.95 90 top
IC1  74LVC1G06DCK  [SC70-5]  43.05,18.41 0 top
JTAG  NA(HN1X6)  [HN1X6]  99.95,30.61 270 top
L1  CL470nH/0805/1.76R/250mA  [L0805_5MIL_DWS]  99.82,66.29 0 top
L2  2.2uH/1.5A/DCR<0.1R/CD32  [CD32]  13.08,43.15 90 top
L3  2.2uH/1.5A/DCR<0.1R/CD32  [CD32]  23.47,36.37 0 top
L4  2.2uH/1.5A/DCR<0.1R/CD32  [CD32]  30.35,43.99 90 top
L5  FB0805/600R/2A  [L0805_5MIL_DWS]  13.97,107.7 180 top
L6  FB0805/600R/2A  [L0805_5MIL_DWS]  13.97,98.81 180 top
L7  FB0805/600R/2A  [L0805_5MIL_DWS]  13.97,88.14 180 top
L8  FB0805/600R/2A  [L0805_5MIL_DWS]  6.45,77.57 180 top
L9  FB0805/600R/2A  [L0805_5MIL_DWS]  32.64,82.93 270 top
L10  2.2uH/1.5A/DCR<0.1R/CD32  [CD32]  28.45,13.21 270 top
L11  FB0805/600R/2A  [L0805_5MIL_DWS]  14.07,64.87 90 top
L12  FB0805/600R/200mA(201209-601)  [L0805_5MIL_DWS]  10.01,64.87 270 top
L13  10uH/3.15A/20%  [8X8MM_3131]  21.72,25.91 90 top
L14  2.2uH/1.5A/DCR<0.1R/CD32  [CD32]  11.46,54.61 0 top
L15  2.2uH/1.5A/DCR<0.1R/CD32  [CD32]  28.52,55.68 270 top
LCD_CON  ML40  [ML40]  49.53,114.3 0 top
LED1  LED/GREEN/0603  [LED-0603]  3.3,53.98 0 top
LIPO_BAT  DW02R  [DW02R]  4.95,20.12 270 top
MIC  PJ-W47S-05D2-LF_V2  [PJ-W47S-05D2-LF_5PIN_V2]  119.63,57.15 180 top
P0  TESTPADTESTPAD_40-ROUND  [TESTPAD_40-ROUND]  39.62,31.11 0 bottom
P1  TESTPADTESTPAD_40-ROUND  [TESTPAD_40-ROUND]  37.08,31.11 0 bottom
P2  TESTPADTESTPAD_40-ROUND  [TESTPAD_40-ROUND]  34.54,31.11 0 bottom
P3  TESTPADTESTPAD_40-ROUND  [TESTPAD_40-ROUND]  32,31.11 0 bottom
P4  TESTPADTESTPAD_40-ROUND  [TESTPAD_40-ROUND]  29.46,31.11 0 bottom
P5  TESTPADTESTPAD_40-ROUND  [TESTPAD_40-ROUND]  26.92,31.11 0 bottom
P6  TESTPADTESTPAD_40-ROUND  [TESTPAD_40-ROUND]  18.92,28.57 0 bottom
P7  TESTPADTESTPAD_40-ROUND  [TESTPAD_40-ROUND]  16.38,28.57 0 bottom
P8  TESTPADTESTPAD_40-ROUND  [TESTPAD_40-ROUND]  13.84,28.57 0 bottom
P9  TESTPADTESTPAD_40-ROUND  [TESTPAD_40-ROUND]  11.3,28.57 0 bottom
P10  TESTPADTESTPAD_40-ROUND  [TESTPAD_40-ROUND]  8.76,28.57 0 bottom
P11  TESTPADTESTPAD_40-ROUND  [TESTPAD_40-ROUND]  40.64,53.34 0 bottom
P12  TESTPADTESTPAD_40-ROUND  [TESTPAD_40-ROUND]  17.78,53.34 0 bottom
PWR  YDJ-1136  [PWR_JACK_UNI_MILLING]  8.26,4.72 0 top
PWR_BUT  T1107A(6x3.8x2.5mm)  [SW-TAKT_6X3.5_SMD]  13.97,2.54 270 top
PWR_LED  LED/RED/0603  [LED-0603]  3.3,42.8 0 top
Q1  HC49/S1  [HC49/SMD2_THIN]  81.58,79.15 180 top
Q2  HC49/S1  [HC49/SMD2_THIN]  28.6,104.8 0 top
Q3  32768Hz/6pF  [MC-306]  97.16,14.4 0 top
R1  2k/1%  [R0603_5MIL_DWS]  54.31,35.03 180 top
R2  2k/1%  [R0603_5MIL_DWS]  54.31,39.6 0 top
R3  NA  [R0603_5MIL_DWS]  80.47,45.39 180 top
R4  47k  [R0603_5MIL_DWS]  41.35,61.14 180 top
R5  47k  [R0603_5MIL_DWS]  93.57,18.72 0 top
R6  2k/1%  [R0603_5MIL_DWS]  54.31,31.83 180 top
R7  200k/1%  [R0603_5MIL_DWS]  84.28,71.42 0 top
R8  2.2k  [R0603_5MIL_DWS]  96.85,55.65 90 top
R9  2.2k  [R0603_5MIL_DWS]  96.85,50.83 90 top
R10  240R/1%  [R0603_5MIL_DWS]  69.01,28.8 180 top
R11  2k/1%  [R0603_5MIL_DWS]  54.31,27.25 0 top
R12  240R/1%  [R0603_5MIL_DWS]  82.71,31.42 270 top
R13  240R/1%  [R0603_5MIL_DWS]  54.31,42.65 0 top
R14  10k  [R0603_5MIL_DWS]  40.64,28.45 0 top
R15  NA(1M)  [R0603_5MIL_DWS]  99.82,72.64 180 top
R16  10k  [R0603_5MIL_DWS]  49.38,27.53 90 top
R17  47k  [R0603_5MIL_DWS]  50.6,61.87 0 top
R18  10k  [R0603_5MIL_DWS]  99.82,71.12 180 top
R19  1.1k/1%  [R0603_5MIL_DWS]  101.3,78.31 180 top
R20  17.8k/1%  [R0603_5MIL_DWS]  96.93,89 0 top
R21  17.8k/1%  [R0603_5MIL_DWS]  96.93,98.15 0 top
R22  17.8k/1%  [R0603_5MIL_DWS]  96.93,107.29 0 top
R23  240R/1%  [R0603_5MIL_DWS]  12.24,49.35 0 top
R24  8.66k/1%  [R0603_5MIL_DWS]  96.93,90.53 0 top
R25  8.66k/1%  [R0603_5MIL_DWS]  96.93,99.67 0 top
R26  8.66k/1%  [R0603_5MIL_DWS]  96.93,108.81 0 top
R27  0.03R/1%  [R1206_5MIL_WS]  8.59,42.39 180 top
R28  4.32k/1%  [R0603_5MIL_DWS]  96.93,87.48 0 top
R29  4.32k/1%  [R0603_5MIL_DWS]  96.93,96.62 0 top
R30  4.32k/1%  [R0603_5MIL_DWS]  96.93,105.77 0 top
R31  2.2k/1%  [R0603_5MIL_DWS]  96.93,85.95 0 top
R32  2.2k/1%  [R0603_5MIL_DWS]  96.93,95.1 0 top
R33  2.2k/1%  [R0603_5MIL_DWS]  96.93,104.24 0 top
R34  1R  [R0603_5MIL_DWS]  19.51,50.72 270 top
R35  1.05k/1%  [R0603_5MIL_DWS]  96.93,84.43 0 top
R36  1.05k/1%  [R0603_5MIL_DWS]  96.93,93.57 0 top
R37  1.05k/1%  [R0603_5MIL_DWS]  96.93,102.72 0 top
R38  549R/1%  [R0603_5MIL_DWS]  96.93,82.91 0 top
R39  549R/1%  [R0603_5MIL_DWS]  96.93,92.05 0 top
R40  549R/1%  [R0603_5MIL_DWS]  96.93,101.19 0 top
R41  1R  [R0603_5MIL_DWS]  21.03,50.22 270 top
R42  NA  [R0603_5MIL_DWS]  96.93,78.33 180 top
R43  51R  [R0603_5MIL_DWS]  96.93,76.81 0 top
R44  NA  [R0603_5MIL_DWS]  96.93,75.29 180 top
R45  2.2k  [R0603_5MIL_DWS]  3.3,51.18 0 top
R46  200k/1%  [R0603_5MIL_DWS]  27,46.99 180 top
R47  10k  [R0603_5MIL_DWS]  21.64,92.46 270 top
R48  6.8k/1%  [R0603_5MIL_DWS]  19.81,85.72 0 top
R49  2.2k  [R0603_5MIL_DWS]  83.31,107.9 270 top
R50  2.2k  [R0603_5MIL_DWS]  84.84,107.9 270 top
R51  47k  [R0603_5MIL_DWS]  86.36,107.9 270 top
R52  2.2k  [R0603_5MIL_DWS]  3.3,56.77 180 top
R53  2.2k  [R0603_5MIL_DWS]  13.31,37.19 0 top
R54  47k  [R0603_5MIL_DWS]  24,83.19 90 top
R55  10k  [R0603_5MIL_DWS]  22.68,100.48 90 top
R56  10k  [R0603_5MIL_DWS]  22.48,83.19 90 top
R57  NA(47k)  [R0603_5MIL_DWS]  24.21,100.48 90 top
R58  NA(5.1k)  [R0603_5MIL_DWS]  25.53,83.19 270 top
R59  2.2k  [R0603_5MIL_DWS]  18.82,36.2 90 top
R60  2.2k  [R0603_5MIL_DWS]  17.3,37.08 270 top
R61  2.2k  [R0603_5MIL_DWS]  15.77,37.08 270 top
R62  4.99k/1%  [R0603_5MIL_DWS]  22.48,12.57 90 top
R63  NA(10k)  [R0603_5MIL_DWS]  27.05,83.19 90 top
R64  47k  [R0603_5MIL_DWS]  16.1,64.87 90 top
R65  3.3k/1%  [R0603_5MIL_DWS]  22.48,17.53 90 top
R66  680R/1%  [R0603_5MIL_DWS]  31.42,100.48 270 top
R67  200k/1%  [R0603_5MIL_DWS]  20.83,76.4 270 top
R68  13k/1%  [R0603_5MIL_DWS]  20.68,64.87 270 top
R69  100k/1%  [R0603_5MIL_DWS]  17.63,64.87 270 top
R70  47k  [R0603_5MIL_DWS]  15.37,17.53 90 top
R71  4.99k/1%  [R0603_5MIL_DWS]  11.18,21.34 270 top
R72  2.2k  [R0603_5MIL_DWS]  3.3,45.59 0 top
R73  2.2k  [R0603_5MIL_DWS]  12.32,17.53 90 top
R74  1.05k/1%  [R0603_5MIL_DWS]  11.18,24.64 90 top
R75  2.2k  [R0603_5MIL_DWS]  82.91,14.94 270 top
R76  100k/1%  [R0603_5MIL_DWS]  103.76,34.67 0 top
R77  2.2k  [R0603_5MIL_DWS]  81.38,14.94 270 top
R78  8.2k/1%  [R0603_5MIL_DWS]  13.49,60.83 0 top
R79  6.8k/1%  [R0603_5MIL_DWS]  107.06,34.67 0 top
R80  8.2k/1%  [R0603_5MIL_DWS]  107.06,28.57 0 top
R81  10k/1%  [R0603_5MIL_DWS]  107.06,22.48 0 top
R82  11k/1%  [R0603_5MIL_DWS]  107.06,16.38 0 top
R83  13k/1%  [R0603_5MIL_DWS]  107.06,10.29 0 top
R84  100k/1%  [R0603_5MIL_DWS]  22.56,55.04 90 top
R85  1.1k/1%  [R0603_5MIL_DWS]  9.42,60.83 180 top
R86  22k/1%  [R0603_5MIL_DWS]  22.56,59.99 90 top
R87  22R  [R0603_5MIL_DWS]  79.71,47.78 90 top
R88  22R  [R0603_5MIL_DWS]  81.23,47.78 90 top
R89  22R  [R0603_5MIL_DWS]  73.66,44.04 90 top
R90  22R  [R0603_5MIL_DWS]  75.21,44.04 90 top
R91  22R  [R0603_5MIL_DWS]  72.14,44.04 90 top
R92  22R  [R0603_5MIL_DWS]  62.2,41.17 90 top
R93  22R  [R0603_5MIL_DWS]  63.73,41.17 90 top
R94  22R  [R0603_5MIL_DWS]  65.25,41.17 90 top
R95  NA  [R0603_5MIL_DWS]  20.12,92.46 270 top
R96  10k  [R0603_5MIL_DWS]  99.95,60.45 180 top
R97  10k  [R0603_5MIL_DWS]  42.57,25.3 180 top
R98  51R  [R0603_5MIL_DWS]  96.93,79.86 0 top
R99  51R  [R0603_5MIL_DWS]  96.93,81.38 0 top
R100  1.1k/1%  [R0603_5MIL_DWS]  101.3,89.38 180 top
R101  1.1k/1%  [R0603_5MIL_DWS]  101.3,83.85 180 top
R102  4.32k/1%  [R0603_5MIL_DWS]  101.09,115.06 0 top
R103  10k  [R0603_5MIL_DWS]  94.11,10.67 180 top
R104  10k  [R0603_5MIL_DWS]  33.15,19.3 90 top
RESET  T1107A(6x3.8x2.5mm)  [SW-TAKT_6X3.5_SMD]  13.97,116.84 90 top
RESET_N  TESTPAD40/70  [TESTPAD]  99.95,21.72 0 top
RM1  RA0805_(4X0402)_22R  [R_MATRIX_4_0402_25X625]  60.12,41.91 180 top
RM2  RA0805_(4X0402)_22R  [R_MATRIX_4_0402_25X625]  77.32,44.78 180 top
RM3  RA0805_(4X0402)_22R  [R_MATRIX_4_0402_25X625]  67.34,41.58 180 top
RM4  RA0805_(4X0402)_22R  [R_MATRIX_4_0402_25X625]  70,44.32 180 top
RM5  RA0805_(4X0402)_22R  [R_MATRIX_4_0402_25X625]  87.3,54.61 180 top
RM6  RA0805_(4X0402)_22R  [R_MATRIX_4_0402_25X625]  84.48,49.12 180 top
RM7  RA0805_(4X0402)_22R  [R_MATRIX_4_0402_25X625]  82.88,51.46 180 top
RM8  RA0805_(4X0402)_22R  [R_MATRIX_4_0402_25X625]  88.9,49.12 180 top
RM9  RA0805_(4X0402)_22R  [R_MATRIX_4_0402_25X625]  86.08,52.05 180 top
RM10  RA0805_(4X0402)_22R  [R_MATRIX_4_0402_25X625]  90.5,52.04 180 top
RM12  RA1206_(4X0603)_4B8_100K  [R_MATRIX_4]  99.82,63.25 270 top
RM16  RA0805_(4X0402)_22R  [R_MATRIX_4_0402_25X625]  96.85,47.73 90 top
SD  MICRO_SD/MMC_CP_NEWTFC-WPAPR-08  [TFC-WPAPR-08]  110.75,68.21 0 top
SW1  T1107A(6x3.8x2.5mm)  [SW-TAKT_6X3.5_SMD]  114.17,34.67 270 top
SW2  T1107A(6x3.8x2.5mm)  [SW-TAKT_6X3.5_SMD]  114.17,28.57 270 top
SW3  T1107A(6x3.8x2.5mm)  [SW-TAKT_6X3.5_SMD]  114.17,22.48 270 top
SW4  T1107A(6x3.8x2.5mm)  [SW-TAKT_6X3.5_SMD]  114.17,16.38 270 top
SW5  T1107A(6x3.8x2.5mm)  [SW-TAKT_6X3.5_SMD]  114.17,10.29 270 top
U1  K4B2G0846Q-BCKO  [FBGA78]  61.51,31.57 270 top
U2  K4B2G0846Q-BCKO  [FBGA78]  76.51,31.57 270 top
U3  A13  [TQFP176]  68.91,61.72 0 top
U4  H27UBG8T2BTR  [TSOP48]  44.5,40.23 90 top
U5  SN74ALVC244  [PW]  91.26,85.01 90 top
U6  SN74ALVC244  [PW]  91.26,94.03 90 top
U7  SN74ALVC244  [PW]  91.26,103.05 90 top
U8  SY6280  [SOT23-5]  19.81,88.67 270 top
U9  AXP209(QFN48)  [QFN48]  20.5,44.04 0 top
U10  SY8008C(AA)C  [SOT23-5]  25.15,17.02 270 top
U11  GL850G-HHGXX  [SSOP28]  27.94,92.28 180 top
U12  SY6280  [SOT23-5]  19.3,72.57 270 top
U13  MP1482DS  [SOIC8]  14.61,23.11 180 top
U14  PCF8563T/5  [SO-8]  87.78,15.67 90 top
U15  SY8008C(AA)C  [SOT23-5]  25.22,59.49 270 top
U16  SY7208(SOT23-6)  [SOT23-6]  11.46,58.29 0 top
U17  ATTINY102F-SSNRSOIC8_SA_SST_MCH-L  [SOIC8_SA_SST_MCH-L]  109.22,112.78 0 top
U$1  FIDUCIAL1X2  [FIDUCIAL-1X2]  2.54,2.54 180 top
U$2  FIDUCIAL1X2  [FIDUCIAL-1X2]  2.54,111.12 180 top
U$3  FIDUCIAL1X2  [FIDUCIAL-1X2]  116.84,111.12 180 top
U$4  NANO_ITX  [NANO-ITX_120X120]  119.38,119.38 180 top
U$5  [LOGO-OPENHARDWARE_8X8]  87.27,43.66 0 top
U$6  [OLIMEX1_V]  36.68,91.01 0 bottom
U$8  [OLIMEX1_V]  68.63,76.48 0 top
U$9  [PB]  90.83,35.48 0 top
U$10  [ESD_SYMBOL]  91.16,29.11 0 top
U$11  [RECYCLE_BIN1/8]  83.74,29.01 0 top
U$12  [ROHS]  81.15,20.4 0 top
UART0  NA(HN1X4)  [HN1X4]  105.28,1.91 0 top
UART1  HN1X4  [HN1X4]  105.28,117.47 0 top
UEXT  BH10S  [ML10-MALE]  88.9,114.3 0 top
USB_HOST1  USB_A_VERTICAL  [USB_A_VERTICAL_PTH]  -9.27,106.68 270 top
USB_HOST2  USB_A_VERTICAL  [USB_A_VERTICAL_PTH]  -9.27,96.01 270 top
USB_HOST3  USB_A_VERTICAL  [USB_A_VERTICAL_PTH]  -9.27,85.34 270 top
USB_OTG  USB-OTG  [USB_MINI_9PIN]  4.32,68.71 0 top
VGA_DB15-F  VGA15  [DB15-F_22MM]  111.43,94.06 90 top
WIFI  HN1X4  [HN1X4]  36.2,92.28 90 top
WIFI-3.3V/5V_USB  [SJ_2_SMALL_12_TIED]  35.18,77.65 180 top

## Tracks (layer width: path | path; a pad name or v marks a point on that pad's centre or on a via)
#OVCUR1
  Top 0.356: U11.21 27.61,84.64 R63.2
  Top 1.016: R63.2 R58.1
+5V  (via drill 0.6)
  Top 0.356: 28.91,87.02 U11.23 | 28.91,87.02 v28.71,87.02 | 28.91,84.07 28.91,87.02
  Top 0.381: U8.1 18.86,89.73 18.98,89.85
  Top 0.508: v21.69,87.02 21.69,88.14 21.13,88.7 20.14,88.7 18.98,89.85 U8.5 18.86,91.3 C92.1 | 5V_E.2 17.42,32.36 17.4,32.38 | 35.18,75.18 5V_E_WIFI.1 | R104.2 33.15,26.42 31.77,27.79 C143.+ | 16.36,87.37 U8.1
  Top 0.61: v99.42,89.38 100.2,89.38 | 100.2,89.38 R100.2 | v99.42,83.84 R101.2 | C92.1 18.16,91.57 17.48,92.25 17.48,99.16 17.68,99.36 | 23.88,31.9 5V_E.2 | v23.88,31.75 23.88,31.9 | 23.88,31.9 30.58,31.9 | 30.58,31.9 32.05,31.9 34.14,33.98 34.14,54.46 v34.29,54.61 | C119.1 18.35,75.51 | 18.35,75.51 U12.5 | 18.35,75.51 C140.1 | 30.58,31.9 30.58,31.7 | D5.2 100.08,95.02 100.91,95.02 v101.14,94.79 | D6.2 100.2,90.89 100.2,89.38 | 24.35,80.68 23.93,80.26 16.36,80.26 | 24.35,80.68 25.53,81.86 R58.2 | 24.35,80.68 v24.64,80.39
  Top 0.762: 15.49,33.48 15.49,33.4 16.38,33.4 17.4,32.38 | 15.49,33.48 D7.K | FET3.2 13.52,33.34 13.66,33.48 15.49,33.48 | C101.1 30.53,84.07 31.24,83.36 31.24,77.6 33.66,75.18 35.18,75.18 v35.18,74.4 | v37.24,77.65 WIFI-3.3V/5V_USB.1
  Top 1.016: C101.1 28.91,84.07 C98.1 | 20.75,101.37 19.68,101.37 17.68,99.36 | 20.75,101.37 R55.2 | LCD_CON.1 20.75,108.38 20.75,101.37 | v16.79,75.51 C119.1 | 30.58,31.7 C143.+ | L8.1 7.72,77.32 8.74,77.32 8.94,77.11 14.63,77.11 16.36,78.84 16.36,80.26 16.36,81.92 | C91.+ 16.36,102.13 16.36,98.81 | 16.36,88.14 16.36,87.37 16.36,81.92 | 16.36,98.81 L6.1 | 16.36,92.58 C99.+ | 16.36,92.58 16.36,98.81 | 16.36,88.14 L7.1 | 16.36,88.14 16.36,92.58 | 16.36,81.92 C107.+
  Bottom 0.254: 23.88,28.57 P6.1
  Bottom 0.508: 99.42,90.68 99.42,93.12 101.09,94.79 v101.14,94.79 | v99.42,83.84 v99.42,89.38 99.42,90.68 | v16.79,75.51 18.03,75.51 21.49,78.97 21.49,86.82 v21.69,87.02 v28.71,87.02 53.39,87.02 57.05,90.68 99.42,90.68
  Bottom 0.61: v23.88,31.75 23.88,28.57 23.88,3.05 24.59,2.34 75.18,2.34 | 75.18,2.34 94.79,2.34 95.5,3.05 95.5,4.83 95.3,5.03 | 75.18,2.34 75.18,4.83 74.98,5.03 | v34.29,54.61 35.36,55.68 35.36,74.22 v35.18,74.4
  Bottom 0.762: v37.24,77.65 27.38,77.65 v24.64,80.39
  Bottom 1.016: 95.3,5.03 GPIO-1.1 | 74.98,5.03 GPIO-2.1
+5V_OTG_PWR  (via drill 0.4, 0.6)
  Top 0.203: U9.31 20.3,47.81 20.45,47.95
  Top 0.508: R41.2 20.52,48.82 v20.52,48.21 20.52,48.03 20.45,47.95 | USB_OTG.VBUS | v8.74,70.31 USB_OTG.VBUS
  Top 0.61: v19.71,57.25 19.71,61.37 18.49,62.59 15.34,62.59 L11.1
  Top 1.016: L11.1 14.07,63.98 C118.1 v12.04,62.99
  Bottom 0.254: 20.52,53.34 P12.1
  Bottom 0.61: v20.52,48.21 20.52,53.34 20.52,56.44 v19.71,57.25
  Bottom 1.016: v12.04,62.99 8.74,66.29 v8.74,70.31
+15V  (via drill 0.6, 0.8)
  Top 0.203: U9.33 19.5,48.01 19.71,48.01 19.9,48.01 U9.32
  Top 0.508: 17.42,30.89 5V_E.1
  Top 0.61: 19.71,48.01 19.71,48.64 v19.51,48.84 R34.2
  Top 1.016: C128.1 | R71.2 10.29,20.45 9.78,20.95 9.78,28.78 10.59,29.59 C128.1 | C128.1 C129.1 13.16,29.59 | L13.2 21.13,29.59 17.42,29.59 | 15.49,29.59 17.42,29.59 | 15.49,29.59 D7.A | 13.16,29.59 FET3.1 | 13.16,29.59 15.49,29.59 | 17.42,29.59 17.42,30.89 | C128.1 v11.18,30.73 | R72.1 v2.41,46.58 2.87,47.04 v5.59,47.04
  Bottom 0.254: v11.18,30.73 11.3,30.61 P9.1
  Bottom 0.61: v5.59,47.04 5.99,47.45 18.49,47.45 19.51,48.46 v19.51,48.84
  Bottom 1.016: v11.18,30.73 11.18,37.82 v2.41,46.58
+24V  (via drill 0.4, 0.6)
  Top 0.203: 16.03,44.27 16.06,44.24 U9.42 | U9.38 16.86,45.84 16.74,45.72 16.74,45.44 U9.39
  Top 0.254: v15.34,44.68 15.62,44.68 16.03,44.27
  Top 0.61: 16.74,45.72 16.54,45.92 v16.54,46 v16.54,46.63
  Top 1.016: LIPO_BAT.1 5.06,21.01 C135.2 | 7.44,42.39 R27.2 | 7.44,42.39 C77.1 v6.45,40.36 | 7.44,42.39 7.44,44.42 | 7.44,44.42 C75.2 | 7.44,44.42 v7.44,45.41
  Bottom 0.254: 3.13,22.94 P10.1
  Bottom 0.61: 16.54,46.53 v16.54,46.63
  Bottom 0.813: 15.34,45.21 15.75,45.21 v16.54,46 16.54,46.53 | v7.44,45.41 7.64,45.21 15.34,45.21 | 15.34,45.21 v15.34,44.68
  Bottom 1.016: LIPO_BAT.1 3.13,22.94 1.32,24.75 1.32,35.23 v6.45,40.36
A0  (via drill 0.25, 0.25 pad 0.46)
  Top 0.152: RM5.1.2 88.14,54.01 88.14,50.67 87.76,50.29 87.76,28.19 82.55,22.99 78.88,22.99 78.27,23.6 v78.03,23.6 77.38,23.6 76.22,24.75 76.22,28.21 75.26,29.17 U2.K3 | U1.K3 60.24,29.17 61.21,28.19 61.21,25.88 63.5,23.6 v64.44,23.6
  Bottom 0.152: v64.44,23.6 v78.03,23.6
A1  (via drill 0.25 pad 0.46)
  Top 0.127: 78.61,27.97 79.11,27.97 79.31,27.77 79.31,27.37 79.51,27.17 79.91,27.17
  Top 0.152: U2.L7 78.51,27.97 78.61,27.97 | 79.91,27.17 79.94,27.17 80.12,26.98 80.5,26.98 81.66,28.13 v81.66,28.4 81.81,28.55 83.8,28.55 84.71,29.46 84.71,47.75 84.23,48.23 RM6.3.2 | U1.L7 v63.51,28.77
  Bottom 0.127: 63.96,28.27 64.54,28.27
  Bottom 0.152: v81.66,28.4 81.16,27.89 80.11,27.89 80.01,27.79 72.57,27.79 71.96,27.18 67.56,27.18 66.95,27.79 65.02,27.79 64.54,28.27 | v63.51,28.77 63.51,28.72 63.96,28.27
A2  (via drill 0.25, 0.25 pad 0.46)
  Top 0.152: RM8.3.2 88.65,48.24 88.37,47.95 88.37,27.94 82.8,22.38 78.62,22.38 78.32,22.68 v78.08,22.68 77.43,22.68 75.64,24.47 75.64,27.9 75.17,28.37 U2.L3 | U1.L3 60.18,28.37 60.63,27.91 60.63,25.6 63.55,22.68 v64.44,22.68
  Bottom 0.152: v64.44,22.68 v78.08,22.68
A3  (via drill 0.25, 0.25 pad 0.46)
  Top 0.127: 75.11,28.77 74.71,28.77 | 60.11,28.77 59.51,28.77
  Top 0.152: RM8.4.2 88.06,48.52 88.06,28.07 82.68,22.68 78.75,22.68 78.29,23.14 v77.62,23.14 77.4,23.14 75.93,24.61 75.93,28.05 75.21,28.77 75.11,28.77 | U2.K2 74.51,28.77 74.71,28.77 | 59.51,28.77 U1.K2 | 60.11,28.77 60.21,28.77 60.92,28.05 60.92,25.74 63.52,23.14 v63.98,23.14
  Bottom 0.152: v63.98,23.14 v77.62,23.14
A4  (via drill 0.25 pad 0.46)
  Top 0.127: U2.L8 79.11,28.37 79.51,27.97 79.94,27.97
  Top 0.152: 79.94,27.97 80.01,27.89 80.53,27.89 81.05,28.41 v81.05,28.55 81.36,28.85 83.67,28.85 84.4,29.59 84.4,47.57 83.73,48.25 RM6.4.2 | U1.L8 v64.26,28.71
  Bottom 0.152: v81.05,28.55 80.81,28.79 80.07,28.79 79.38,28.09 65.18,28.09 64.56,28.71 v64.26,28.71
A5  (via drill 0.25, 0.25 pad 0.46)
  Top 0.127: 75.11,27.97 74.71,27.97 | 60.14,27.97 59.51,27.97
  Top 0.152: RM8.2.2 89.15,48.23 88.67,47.75 88.67,27.81 82.93,22.07 78.49,22.07 78.33,22.23 v77.67,22.23 77.45,22.23 75.35,24.33 75.35,27.76 75.14,27.97 75.11,27.97 | U2.L2 74.51,27.97 74.71,27.97 | 59.51,27.97 U1.L2 | 60.14,27.97 60.34,27.77 60.34,25.46 63.58,22.23 v63.98,22.23
  Bottom 0.152: v63.98,22.23 v77.67,22.23
A6  (via drill 0.25 pad 0.46)
  Top 0.127: 78.91,27.37 79.31,26.97 79.31,26.57
  Top 0.152: 78.91,27.37 U2.M8 | 79.31,26.57 79.31,26.44 80.02,25.73 80.43,25.73 82.19,27.5 v82.19,28.09 82.35,28.25 83.92,28.25 85.01,29.34 85.01,47.95 84.73,48.24 RM6.2.2 | U1.M8 v64.19,27.84
  Bottom 0.152: v82.19,28.09 82.04,27.94 81.66,27.94 80.67,26.95 78.99,26.95 78.46,27.48 77.22,27.48 76.61,26.87 65.05,26.87 64.82,27.1 64.82,27.33 64.31,27.84 v64.19,27.84
A7  (via drill 0.25, 0.25 pad 0.46)
  Top 0.127: 73.71,26.57 73.71,26.97 | 58.71,26.57 58.71,27.17
  Top 0.152: RM10.2.2 90.75,51.25 90.65,51.16 90.65,47.88 89.89,47.12 89.89,27.3 82.98,20.4 v77.72,20.4 77.55,20.4 73.71,24.23 73.71,26.57 | U2.M2 73.71,27.17 73.71,26.97 | 58.71,27.17 U1.M2 | v63.98,20.4 63.68,20.4 58.71,25.36 58.71,26.57
  Bottom 0.152: v63.98,20.4 v77.72,20.4
A8  (via drill 0.25 pad 0.46)
  Top 0.152: U2.N8 78.95,26.72 78.95,26.36 79.89,25.43 80.57,25.43 82.73,27.58 v82.73,27.79 82.88,27.94 84.05,27.94 85.32,29.21 85.32,48.52 RM6.1.2 | U1.N8 v64.31,27.17
  Bottom 0.152: v82.73,27.79 82.58,27.64 81.79,27.64 80.8,26.64 78.84,26.64 78.31,27.18 77.34,27.18 76.73,26.57 64.91,26.57 v64.31,27.17
A9  (via drill 0.25, 0.25 pad 0.46)
  Top 0.127: 74.51,26.57 74.51,26.97 | 59.51,27.17 59.51,26.57
  Top 0.152: RM10.4.2 89.75,51.17 90.04,50.88 90.04,48.13 89.28,47.37 89.28,27.56 83.03,21.31 v77.72,21.31 77.5,21.31 74.51,24.3 74.51,26.57 | U2.M3 74.51,27.17 74.51,26.97 | U1.M3 59.51,27.17 | v63.98,21.31 63.63,21.31 59.51,25.43 59.51,26.57
  Bottom 0.152: v63.98,21.31 v77.72,21.31
A10  (via drill 0.25, 0.25 pad 0.46)
  Top 0.127: U2.H7 78.32,30.76 78.71,30.37 79.11,30.37 | 79.41,30.37 79.94,30.37 79.96,30.39
  Top 0.152: RM7.3.2 82.63,50.67 82.73,50.57 82.73,47.88 83.49,47.12 83.49,29.97 83.29,29.77 82.12,29.77 81.31,30.58 v81.31,30.61 81.15,30.77 80.34,30.77 79.96,30.39 | 79.41,30.37 79.11,30.37 | U1.H7 v63.44,31.09
  Bottom 0.152: v81.31,30.61 81,30.91 80.11,30.91 78.97,29.77 66.42,29.77 65.1,31.09 v63.44,31.09
A11  (via drill 0.25 pad 0.46)
  Top 0.127: 78.51,26.54 78.51,26.97
  Top 0.152: RM9.4.2 85.33,51.17 85.62,50.88 85.62,29.08 83.95,27.41 v83.5,27.41 83.42,27.33 82.92,27.33 80.7,25.12 79.77,25.12 78.65,26.24 78.65,26.4 78.51,26.54 | U2.M7 78.51,27.17 78.51,26.97 | U1.M7 v63.51,27.97
  Bottom 0.127: 63.87,27.5 63.87,26.96 63.89,26.94
  Bottom 0.152: v83.5,27.41 83.42,27.33 82.02,27.33 80.42,25.73 79.3,25.73 78.16,26.87 77.47,26.87 76.86,26.26 66.8,26.26 | 66.8,26.26 66.73,26.26 | v63.51,27.97 63.51,27.87 63.87,27.5 | 63.89,26.94 64.57,26.26 66.8,26.26
A12  (via drill 0.25 pad 0.46)
  Top 0.127: 79.11,28.77 78.61,28.77 | 79.91,28.77 79.51,28.77
  Top 0.152: RM7.1.2 83.63,50.59 83.34,50.29 83.34,48.13 84.1,47.37 84.1,29.72 83.54,29.16 81.04,29.16 v80.96,29.23 80.52,28.79 80.09,28.79 80.06,28.77 79.91,28.77 | U2.K7 78.51,28.77 78.61,28.77 | 79.51,28.77 79.11,28.77 | U1.K7 v63.44,29.49
  Bottom 0.127: 63.98,29.14 64.55,29.14
  Bottom 0.152: 63.98,29.14 63.93,29.14 63.57,29.49 v63.44,29.49 | v80.96,29.23 80.96,29.3 80.57,29.69 80.06,29.69 78.77,28.4 65.33,28.4 64.59,29.14 64.55,29.14
A13  (via drill 0.25, 0.25 pad 0.46)
  Top 0.152: RM8.1.2 89.65,48.25 88.98,47.57 88.98,27.69 83.06,21.77 v78.13,21.77 77.47,21.77 74.91,24.33 U2.N3 | v64.44,21.77 63.6,21.77 59.91,25.46 U1.N3
  Bottom 0.152: v64.44,21.77 v78.13,21.77
A14  (via drill 0.25 pad 0.46)
  Top 0.152: RM9.3.2 85.83,51.25 85.93,51.16 85.93,28.96 | U2.N7 78.17,26.71 78.17,26.44 78.34,26.26 78.34,26.11 79.64,24.82 80.83,24.82 82.89,26.87 v83.11,26.87 83.84,26.87 85.93,28.96 | 85.93,28.96 85.93,29.01 | U1.N7 v63.44,27.09
  Bottom 0.152: v83.11,26.87 81.99,26.87 80.54,25.43 79.17,25.43 78.03,26.57 77.6,26.57 76.99,25.96 64.44,25.96 63.44,26.96 v63.44,27.09
AVDD  (via drill 0.6)
  Top 0.356: U11.10 26.32,96.75 27.25,97.69 v27.25,98.6 C110.1 | C111.1 v29.9,98.6 29.57,98.27 U11.5 | C112.1 v32.94,98.6 32.61,98.6 32.16,98.15 U11.1
  Top 0.508: L9.2 33.12,81.92 34.7,83.49 34.7,97.99 34.09,98.6 v32.94,98.6
  Bottom 0.61: v27.25,98.6 v29.9,98.6 v32.94,98.6
BA0  (via drill 0.25, 0.25 pad 0.46)
  Top 0.127: 75.11,29.57 74.71,29.57 | 60.11,29.57 59.51,29.57
  Top 0.152: RM5.2.2 87.55,53.57 87.83,53.29 87.83,50.8 87.45,50.42 87.45,28.32 82.42,23.29 79,23.29 78.24,24.05 v77.57,24.05 77.35,24.05 76.51,24.89 76.51,28.35 75.3,29.57 75.11,29.57 | U2.J2 74.51,29.57 74.71,29.57 | 59.51,29.57 U1.J2 | 60.11,29.57 60.27,29.57 61.51,28.33 61.51,26.02 63.48,24.05 v63.98,24.05
  Bottom 0.152: v63.98,24.05 v77.57,24.05
BA1  (via drill 0.25 pad 0.46)
  Top 0.127: 79.94,29.57 79.41,29.57
  Top 0.152: RM7.2.2 83.13,50.67 83.03,50.57 83.03,48.01 83.8,47.24 83.8,29.84 83.41,29.46 81.84,29.46 81.46,29.84 v81.08,29.84 80.92,29.69 80.06,29.69 79.94,29.57 | U2.K8 79.31,29.57 79.41,29.57 | U1.K8 v64.31,29.57
  Bottom 0.152: v81.08,29.84 81.08,30.18 80.64,30.61 80.24,30.61 79.1,29.46 66.27,29.46 65.56,30.17 64.91,30.17 v64.31,29.57
BA2  (via drill 0.25, 0.25 pad 0.46)
  Top 0.152: RM5.3.2 87.05,53.64 87.53,53.16 87.53,50.93 87.15,50.55 87.15,28.45 82.3,23.6 79.13,23.6 78.22,24.51 v77.98,24.51 77.33,24.51 76.81,25.03 76.81,28.49 75.33,29.97 U2.J3 | U1.J3 60.31,29.97 61.8,28.47 61.8,26.16 63.45,24.51 v64.44,24.51
  Bottom 0.152: v64.44,24.51 v77.98,24.51
CASN  (via drill 0.25, 0.25 pad 0.46)
  Top 0.152: RM9.1.2 86.83,51.17 86.54,50.88 86.54,28.7 82.04,24.21 79.39,24.21 78.17,25.43 v77.93,25.43 77.83,25.43 77.39,25.87 77.39,29.09 U2.G3 | U1.G3 62.38,29.09 62.38,26.44 63.02,25.81 63.5,25.81 v63.65,25.65
  Bottom 0.152: v77.93,25.43 77.32,25.43 77.24,25.35 64.06,25.35 63.75,25.65 v63.65,25.65
CKE  (via drill 0.25 pad 0.46)
  Top 0.152: RM7.4.2 82.13,50.59 82.42,50.29 82.42,47.75 83.19,46.99 83.19,34.15 80.97,31.94 v80.97,31.67 80.87,31.57 U2.G9 | U1.G9 66.05,30.23 v66.65,30.23
  Bottom 0.152: v80.97,31.67 80.44,31.67 78.84,30.07 66.8,30.07 v66.65,30.23
CLK  (via drill 0.25)
  Top 0.114: U1.F7 62.93,32.18 62.79,32.18 62.23,32.74 62.23,32.89 v62.15,32.97 | R87.1 80.31,46.28 80.31,45.39 | 80.31,45.39 80.31,42.52 82.19,40.64 82.19,34.19 80.34,32.33 80.19,32.33 80.14,32.38 80.14,32.56 79.93,32.77 79.54,32.77 79.39,32.62 79.24,32.62 79.09,32.77 78.01,32.77 77.91,32.67 77.91,32.57 78.09,32.39 | 80.31,45.39 R3.2 | 78.09,32.39 U2.F7 | 78.09,32.39 77.36,32.39 77.16,32.19 77.16,31.96 77.06,31.86 76.91,31.86 76.39,32.38 v76.35,32.38
  Bottom 0.114: v76.35,32.38 76.15,32.18 73.58,32.18 73.13,32.64 65.23,32.64 64.67,33.2 62.38,33.2 v62.15,32.97
CLKN  (via drill 0.25, 0.25 pad 0.46)
  Top 0.114: 80.63,45.39 80.63,46.29 R88.1 | 80.63,45.39 R3.1 | v76.41,31.74 76.61,31.54 78.09,31.54 U2.G7 78.31,31.57 78.71,31.97 80.44,31.97 82.51,34.04 82.51,40.78 80.63,42.66 80.63,45.39 | U1.G7 63.02,31.57 62.76,31.83 62.61,31.83 62.08,32.36 v61.92,32.36
  Bottom 0.114: v76.41,31.74 76.3,31.85 73.46,31.85 72.97,32.33 65.08,32.33 64.54,32.87 62.74,32.87 62.23,32.36 v61.92,32.36
D0
  Top 0.127: 59.51,36.57 59.51,35.97
  Top 0.152: 59.51,35.97 U1.B3 | 59.51,36.57 59.51,37.17 59.21,37.47 58.06,37.47 57.71,37.12 57.71,36.4 57.56,36.25 57.12,36.25 56.97,36.4 56.97,37.91 59.17,40.11 59.94,40.11 60.87,41.03 RM1.1.2
D1
  Top 0.127: 63.71,35.17 64.91,35.17 65.24,35.49
  Top 0.152: RM3.4.2 66.58,39.94 65.89,39.24 65.89,35.64 65.74,35.49 65.24,35.49 | U1.C7 63.11,34.99 63.28,35.17 63.71,35.17
D2
  Top 0.127: 58.51,35.17 58.1,35.17 57.99,35.28 57.56,35.28
  Top 0.152: U1.C2 59.11,34.95 58.89,35.17 58.51,35.17 | RM1.2.2 60.37,40.99 59.79,40.41 59.03,40.41 56.67,38.05 56.67,34.49 56.82,34.34 57.05,34.34 57.2,34.49 57.2,35.1 57.38,35.28 57.56,35.28
D3
  Top 0.127: 64.31,34.37 65.11,34.37 65.29,34.54 65.31,34.54
  Top 0.152: RM3.3.2 67.08,40.01 66.19,39.12 66.19,34.72 66.01,34.54 65.31,34.54 | U1.C8 63.91,34.64 64.19,34.37 64.31,34.37
D4
  Top 0.114: U1.E3 59.71,33.17 59.31,33.57
  Top 0.127: 58.11,33.57 59.31,33.57
  Top 0.152: RM1.4.2 59.37,41.13 59.26,41.02 58.73,41.02 56.06,38.35 56.06,34.04 56.67,33.43 57.91,33.43 58.05,33.57 58.11,33.57
D5
  Top 0.127: 65.01,32.77 64.31,32.77
  Top 0.152: RM3.1.2 68.08,40.15 66.8,38.86 66.8,33.83 65.61,32.64 65.24,32.64 65.11,32.77 65.01,32.77 | 64.31,32.77 U1.E8
D6
  Top 0.127: 57.51,34.37 58.51,34.37
  Top 0.152: U1.D2 59.11,34.06 58.8,34.37 58.51,34.37 | RM1.3.2 59.87,40.92 59.66,40.72 58.88,40.72 56.36,38.2 56.36,34.19 56.67,33.88 57.03,33.88 57.51,34.37
D7
  Top 0.127: 63.51,33.57 64.91,33.57 64.94,33.59
  Top 0.152: RM3.2.2 67.58,40.08 66.5,38.99 66.5,33.96 66.13,33.59 64.94,33.59 | U1.E7 63.11,33.39 63.28,33.57 63.51,33.57
D8
  Top 0.127: 79.11,34.77 79.51,35.17 79.89,35.17 79.92,35.2 80.47,35.2
  Top 0.152: U2.C8 79.11,34.77 | 80.47,35.2 80.9,35.64 80.9,38.38 80.67,38.61 79.91,38.61 79.76,38.76 79.76,38.99 79.91,39.14 80.59,39.14 80.9,39.45 80.9,40.01 78.79,42.11 77.78,42.11 77.07,42.82 RM2.3.2
D9
  Top 0.127: 72.51,34.37 73.51,34.37
  Top 0.152: RM4.3.2 69.75,43.38 70.46,42.67 70.46,39.22 71.22,38.46 71.73,38.46 71.86,38.33 71.86,38.02 71.6,37.77 71.6,33.5 71.75,33.35 72.14,33.35 72.29,33.5 72.29,33.73 72.06,33.96 72.06,34.19 72.24,34.37 72.51,34.37 | U2.D2 73.71,34.37 73.51,34.37
D10
  Top 0.127: 79.11,33.17 79.51,33.57 79.91,33.57 80.04,33.44 80.55,33.44 80.58,33.41
  Top 0.152: U2.E8 79.11,33.17 | 80.58,33.41 80.59,33.4 80.8,33.4 81.51,34.11 81.51,40.26 78.07,43.7 RM2.1.2
D11
  Top 0.127: 73.1,33.57 74.31,33.57 74.65,33.22 74.85,33.22 U2.E3
  Top 0.152: RM4.4.2 69.25,43.45 70.16,42.55 70.16,39.06 71.3,37.92 71.3,33.38 71.63,33.05 72.58,33.05 73.1,33.57
D12
  Top 0.127: 78.71,35.17 79.11,35.17 79.31,35.37 79.31,35.77 | 79.31,36.17 79.31,36.69 79.27,36.73 79.27,36.98
  Top 0.152: U2.C7 78.51,35.17 78.71,35.17 | 79.31,35.77 79.31,36.17 | 79.27,36.98 79.27,37.21 79.83,37.77 80.31,37.77 80.47,37.92 80.47,38.15 80.31,38.3 79.76,38.3 79.45,38.61 79.45,39.14 79.76,39.45 80.44,39.45 80.59,39.6 80.59,39.88 78.66,41.81 77.6,41.81 76.57,42.84 RM2.4.2
D13
  Top 0.127: 73.51,35.17 73.11,35.17 73.04,35.24 72.68,35.24
  Top 0.152: RM4.2.2 70.25,43.31 70.76,42.8 70.76,39.37 71.37,38.76 72.67,38.76 72.82,38.61 72.82,38.3 72.67,38.15 72.44,38.15 72.29,38 72.29,37.77 72.52,37.54 72.52,37.31 72.36,37.16 72.06,37.16 71.91,37.01 71.91,36.8 72.06,36.65 72.67,36.65 72.82,36.5 72.82,36.27 72.67,36.12 72.06,36.12 71.91,35.97 71.91,35.18 72.06,35.03 72.36,35.03 72.58,35.24 72.68,35.24 | U2.C2 73.71,35.17 73.51,35.17
D14
  Top 0.127: 78.71,33.57 79.11,33.57 79.31,33.77 79.31,34.19 | 79.49,34.37 79.96,34.37 80.01,34.31 80.39,34.31
  Top 0.152: U2.E7 78.51,33.57 78.71,33.57 | 79.31,34.19 79.49,34.37 | 80.39,34.31 81.2,35.13 81.2,40.13 77.57,43.77 RM2.2.2
D15
  Top 0.127: 74.51,36.57 74.51,36.17
  Top 0.152: RM4.1.2 70.75,43.24 71.07,42.93 71.07,39.52 71.53,39.06 74.68,39.06 74.91,38.84 74.91,38.23 74.68,38 73.03,38 72.82,37.8 72.82,37.52 73.03,37.31 74.27,37.31 74.51,37.07 74.51,36.57 | U2.B3 74.51,35.97 74.51,36.17
DDR3_A0
  Top 0.152: U3.64 83.91,60.72 88.05,56.58 RM5.1.1
DDR3_A1
  Top 0.152: U3.52 80.98,55.92 84.33,52.58 84.33,50.01 84.23,49.91 RM6.3.1
DDR3_A2
  Top 0.152: U3.66 83.97,61.52 88.75,56.74 88.75,50.01 88.65,49.91 RM8.3.1
DDR3_A3